# Altium project novena_evt1.PrjPcb (part 2 of 4)

## Sheet 06cpu_soc.SchDoc
size B
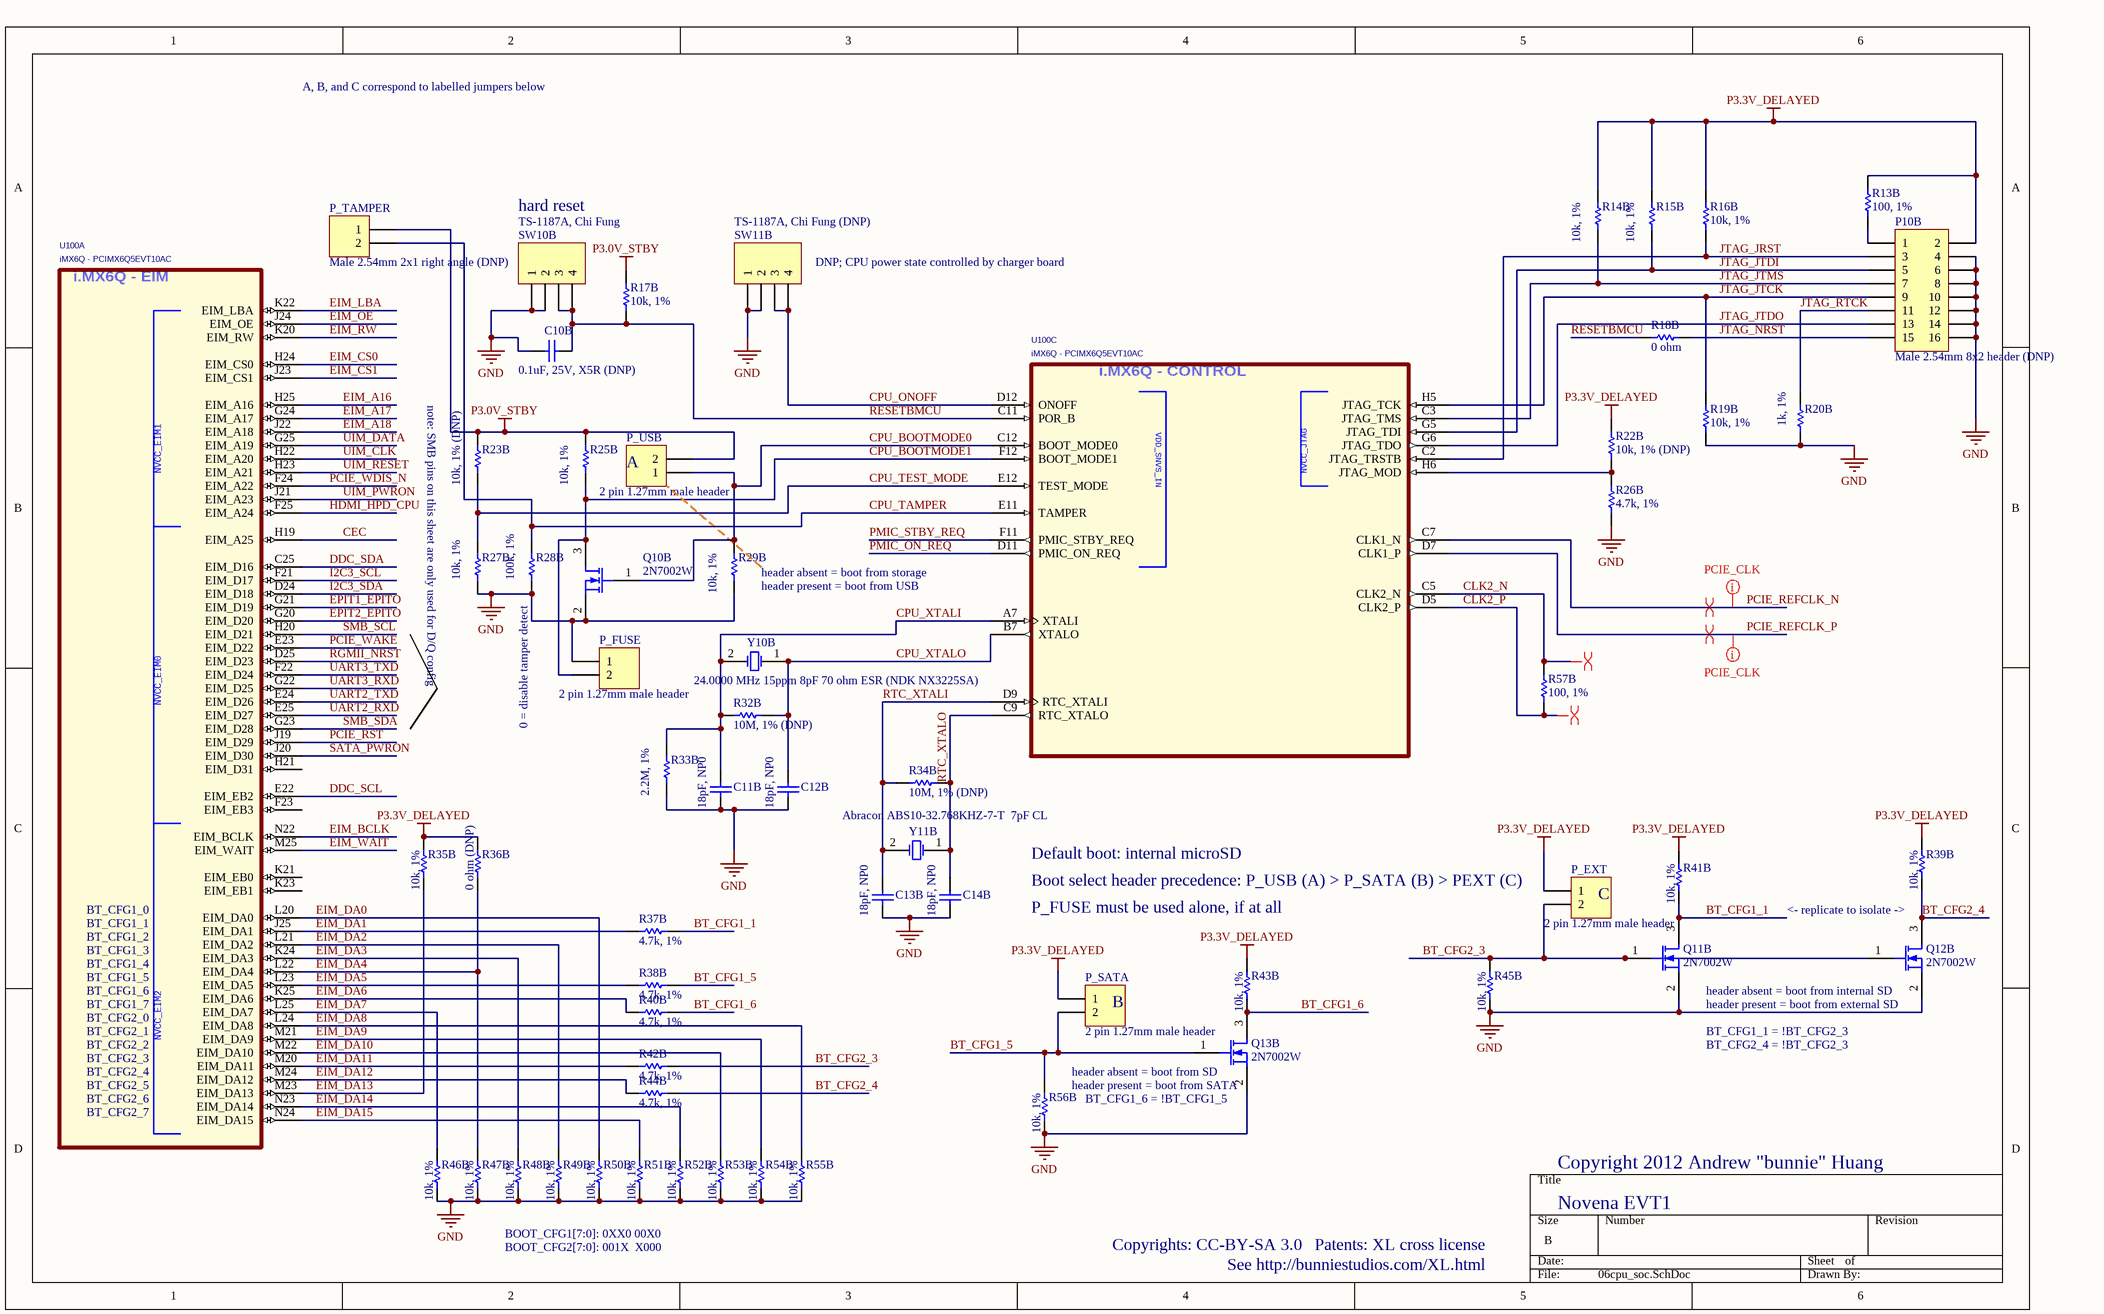
[diagram p5: 06cpu_soc.SchDoc]

### Parts
C10B  0.1uF, 25V, X5R (DNP)  [CAPC1005N]
C11B  18pF, NP0  [CAPC1005N]
C12B  18pF, NP0  [CAPC1005N]
C13B  18pF, NP0  [CAPC1005N]
C14B  18pF, NP0  [CAPC1005N]
P10B  Male 2.54mm 8x2 header (DNP)  [HDR2X8]
P_EXT  2 pin 1.27mm male header  [HEADER_2_1.27MM]
P_FUSE  2 pin 1.27mm male header  [HEADER_2_1.27MM]
P_SATA  2 pin 1.27mm male header  [HEADER_2_1.27MM]
P_TAMPER  Male 2.54mm 2x1 right angle (DNP)  [HDR1X2H]
P_USB  2 pin 1.27mm male header  [HEADER_2_1.27MM]
Q10B  2N7002W  [SOT323-3AN]
Q11B  2N7002W  [SOT323-3AN]
Q12B  2N7002W  [SOT323-3AN]
Q13B  2N7002W  [SOT323-3AN]
R13B  100, 1%  [RESC1005N]
R14B  10k, 1%  [RESC1005N]
R15B  10k, 1%  [RESC1005N]
R16B  10k, 1%  [RESC1005N]
R17B  10k, 1%  [RESC1005N]
R18B  0 ohm  [RESC1005N]
R19B  10k, 1%  [RESC1005N]
R20B  1k, 1%  [RESC1005N]
R22B  10k, 1% (DNP)  [RESC1005N]
R23B  10k, 1% (DNP)  [RESC1005N]
R25B  10k, 1%  [RESC1005N]
R26B  4.7k, 1%  [RESC1005N]
R27B  10k, 1%  [RESC1005N]
R28B  100k, 1%  [RESC1005N]
R29B  10k, 1%  [RESC1005N]
R32B  10M, 1% (DNP)  [RESC1005N]
R33B  2.2M, 1%  [RESC1005N]
R34B  10M, 1% (DNP)  [RESC1005N]
R35B  10k, 1%  [RESC1005N]
R36B  0 ohm (DNP)  [RESC1005N]
R37B  4.7k, 1%  [RESC1005N]
R38B  4.7k, 1%  [RESC1005N]
R39B  10k, 1%  [RESC1005N]
R40B  4.7k, 1%  [RESC1005N]
R41B  10k, 1%  [RESC1005N]
R42B  4.7k, 1%  [RESC1005N]
R43B  10k, 1%  [RESC1005N]
R44B  4.7k, 1%  [RESC1005N]
R45B  10k, 1%  [RESC1005N]
R46B  10k, 1%  [RESC1005N]
R47B  10k, 1%  [RESC1005N]
R48B  10k, 1%  [RESC1005N]
R49B  10k, 1%  [RESC1005N]
R50B  10k, 1%  [RESC1005N]
R51B  10k, 1%  [RESC1005N]
R52B  10k, 1%  [RESC1005N]
R53B  10k, 1%  [RESC1005N]
R54B  10k, 1%  [RESC1005N]
R55B  10k, 1%  [RESC1005N]
R56B  10k, 1%  [RESC1005N]
R57B  100, 1%  [RESC1005N]
SW10B  TS-1187A, Chi Fung  [SWITCH_TS-1187A]
SW11B  TS-1187A, Chi Fung (DNP)  [SWITCH_TS-1187A]
U100  iMX6Q - PCIMX6Q5EVT10AC  [FREESCALE_BGA624C80P25X25_2100X2100X216]  (parts A,C of 12)
Y10B  24.0000 MHz 15ppm 8pF 70 ohm ESR (NDK NX3225SA)  [NDK_NX3225SA]
Y11B  Abracon ABS10-32.768KHZ-7-T  7pF CL  [ABS10-32.768KHZ]

### Nets
GND: C10B.2 C11B.2 C12B.2 C13B.2 C14B.2 P10B.4 P10B.6 P10B.8 P10B.10 P10B.12 P10B.14 P10B.16 P_FUSE.1 Q10B.2(S) Q11B.2(S) Q12B.2(S) Q13B.2(S) R19B.1 R20B.1 R26B.1 R27B.1 R28B.1 R29B.1 R33B.2 R45B.2 R46B.2 R47B.2 R48B.2 R49B.2 R50B.2 R51B.2 R52B.2 R53B.2 R54B.2 R55B.2 R56B.2 SW10B.1 SW10B.2 SW11B.1 SW11B.2
P3.0V_STBY: P_TAMPER.1 P_USB.2 R17B.2 R23B.2 R25B.2
P3.3V_DELAYED: P10B.2 P_EXT.1 P_SATA.1 R13B.2 R14B.2 R15B.2 R16B.2 R22B.2 R35B.1 R36B.1 R39B.1 R41B.1 R43B.1
BT_CFG1_1: Q11B.3(D) R37B.2 R41B.2
BT_CFG1_5: P_SATA.2 Q13B.1(G) R38B.2 R56B.1
BT_CFG1_6: Q13B.3(D) R40B.2 R43B.2
BT_CFG2_3: P_EXT.2 Q11B.1(G) Q12B.1(G) R42B.2 R45B.1
BT_CFG2_4: Q12B.3(D) R39B.2 R44B.2
CEC: U100.H19(EIM_A25)
CLK2_N: R57B.2 U100.C5(CLK2_N)
CLK2_P: R57B.1 U100.D5(CLK2_P)
CPU_BOOTMODE0: P_USB.1 Q10B.1(G) R29B.2 U100.C12(BOOT_MODE0)
CPU_BOOTMODE1: P_FUSE.2 Q10B.3(D) R25B.1 U100.F12(BOOT_MODE1)
CPU_ONOFF: SW11B.3 SW11B.4 U100.D12(ONOFF)
CPU_TAMPER: P_TAMPER.2 R28B.2 U100.E11(TAMPER)
CPU_TEST_MODE: R23B.1 R27B.2 U100.E12(TEST_MODE)
CPU_XTALI: C11B.1 R32B.1 R33B.1 U100.A7(XTALI) Y10B.2(OSC2)
CPU_XTALO: C12B.1 R32B.2 U100.B7(XTALO) Y10B.1(OSC1)
DDC_SCL: U100.E22(EIM_EB2)
DDC_SDA: U100.C25(EIM_D16)
EIM_A16: U100.H25(EIM_A16)
EIM_A17: U100.G24(EIM_A17)
EIM_A18: U100.J22(EIM_A18)
EIM_BCLK: U100.N22(EIM_BCLK)
EIM_CS0: U100.H24(EIM_CS0)
EIM_CS1: U100.J23(EIM_CS1)
EIM_DA0: R50B.1 U100.L20(EIM_DA0)
EIM_DA1: R37B.1 U100.J25(EIM_DA1)
EIM_DA2: R49B.1 U100.L21(EIM_DA2)
EIM_DA3: R48B.1 U100.K24(EIM_DA3)
EIM_DA4: R36B.2 R47B.1 U100.L22(EIM_DA4)
EIM_DA5: R38B.1 U100.L23(EIM_DA5)
EIM_DA6: R40B.1 U100.K25(EIM_DA6)
EIM_DA7: R46B.1 U100.L25(EIM_DA7)
EIM_DA8: R55B.1 U100.L24(EIM_DA8)
EIM_DA9: R54B.1 U100.M21(EIM_DA9)
EIM_DA10: R53B.1 U100.M22(EIM_DA10)
EIM_DA11: R42B.1 U100.M20(EIM_DA11)
EIM_DA12: R44B.1 U100.M24(EIM_DA12)
EIM_DA13: R35B.2 U100.M23(EIM_DA13)
EIM_DA14: R52B.1 U100.N23(EIM_DA14)
EIM_DA15: R51B.1 U100.N24(EIM_DA15)
EIM_LBA: U100.K22(EIM_LBA)
EIM_OE: U100.J24(EIM_OE)
EIM_RW: U100.K20(EIM_RW)
EIM_WAIT: U100.M25(EIM_WAIT)
EPIT1_EPITO: U100.G21(EIM_D19)
EPIT2_EPITO: U100.G20(EIM_D20)
HDMI_HPD_CPU: U100.F25(EIM_A24)
I2C3_SCL: U100.F21(EIM_D17)
I2C3_SDA: U100.D24(EIM_D18)
JTAG_JRST: P10B.3 R16B.1 U100.C2(JTAG_TRSTB)
JTAG_JTCK: P10B.9 R19B.2 U100.H5(JTAG_TCK)
JTAG_JTDI: P10B.5 R15B.1 U100.G5(JTAG_TDI)
JTAG_JTDO: P10B.13 U100.G6(JTAG_TDO)
JTAG_JTMS: P10B.7 R14B.1 U100.C3(JTAG_TMS)
JTAG_NRST: P10B.15 R18B.1
JTAG_RTCK: P10B.11 R20B.2
PCIE_REFCLK_N: U100.C7(CLK1_N)
PCIE_REFCLK_P: U100.D7(CLK1_P)
PCIE_RST: U100.J19(EIM_D29)
PCIE_WAKE: U100.E23(EIM_D22)
PCIE_WDIS_N: U100.F24(EIM_A22)
PMIC_ON_REQ: U100.D11(PMIC_ON_REQ)
PMIC_STBY_REQ: U100.F11(PMIC_STBY_REQ)
RESETBMCU: C10B.1 R17B.1 R18B.2 SW10B.3 SW10B.4 U100.C11(POR_B)
RGMII_NRST: U100.D25(EIM_D23)
RTC_XTALI: C13B.1 R34B.1 U100.D9(RTC_XTALI) Y11B.2(OSC2)
RTC_XTALO: C14B.1 R34B.2 U100.C9(RTC_XTALO) Y11B.1(OSC1)
SATA_PWRON: U100.J20(EIM_D30)
SMB_SCL: U100.H20(EIM_D21)
SMB_SDA: U100.G23(EIM_D28)
UART2_RXD: U100.E25(EIM_D27)
UART2_TXD: U100.E24(EIM_D26)
UART3_RXD: U100.G22(EIM_D25)
UART3_TXD: U100.F22(EIM_D24)
UIM_CLK: U100.H22(EIM_A20)
UIM_DATA: U100.G25(EIM_A19)
UIM_PWRON: U100.J21(EIM_A23)
UIM_RESET: U100.H23(EIM_A21)
NetP10B_1: P10B.1 R13B.1
NetR22B_1: R22B.1 R26B.2 U100.H6(JTAG_MOD)

Not connected (* = marked no-connect by the designer): U100 F23(EIM_EB3) H21(EIM_D31) K21(EIM_EB0) K23(EIM_EB1)

### Layout directives
differential pair: CLK2_N, CLK2_P, PCIE_REFCLK_N, PCIE_REFCLK_P
net class PCIE_CLK: PCIE_REFCLK_N, PCIE_REFCLK_P

### Notes on the sheet
- A, B, and C correspond to labelled jumpers below
- hard reset
- (near SW11B) DNP; CPU power state controlled by charger board
- note: SMB pins on this sheet are only used for D/Q config
- A
- (near R29B) header absent = boot from storage
- (near R29B) header present = boot from USB
- (near R28B) 0 = disable tamper detect
- Default boot: internal microSD
- BT_CFG1_0
- BT_CFG1_1
- (near P_EXT) Boot select header precedence: P_USB (A) > P_SATA (B) > PEXT (C)
- P_FUSE must be used alone, if at all
- (near P_EXT) C
- <- replicate to isolate ->
- BT_CFG1_2
- BT_CFG1_3
- BT_CFG1_4
- BT_CFG1_5
- BT_CFG1_6
- (near Q12B) header absent = boot from internal SD
- BT_CFG1_7
- BT_CFG2_0
- BT_CFG2_1
- BT_CFG2_2
- BT_CFG2_3
- (near P_SATA) B
- header present = boot from external SD
- BT_CFG1_1 = !BT_CFG2_3
- BT_CFG2_4 = !BT_CFG2_3
- BT_CFG2_4
- BT_CFG2_5
- BT_CFG2_6
- BT_CFG2_7
- (near Q13B) header absent = boot from SD
- (near Q13B) header present = boot from SATA
- BT_CFG1_6 = !BT_CFG1_5
- Copyright 2012 Andrew "bunnie" Huang
- BOOT_CFG1[7:0]: 0XX0 00X0
- BOOT_CFG2[7:0]: 001X  X000
- Copyrights: CC-BY-SA 3.0
- Patents: XL cross license
- Novena EVT1
- See http://bunniestudios.com/XL.html
- (in symbol PCIMX6Q6VV1A, part A) i.MX6Q - EIM
- (in symbol PCIMX6Q6VV1A, part C) i.MX6Q - CONTROL

### Library data of the parts
C10B C11B C12B C13B C14B = Cap Semi: Capacitor (Semiconductor SIM Model); Published: 8-Jun-2000; LatestRevisionDate: 17-Jul-2002; LatestRevisionNote: Re-released for DXP Platform.; PackageReference: C1206; Publisher: Altium Limited
P10B = Header 8X2: Header, 8-Pin, Dual row; LatestRevisionDate: 17-Jul-2002; LatestRevisionNote: Re-released for DXP Platform.; Publisher: Altium Limited
P_EXT P_FUSE P_SATA P_USB = Header 2: Header, 2-Pin; LatestRevisionDate: 17-Jul-2002; LatestRevisionNote: Re-released for DXP Platform.; Publisher: Altium Limited
P_TAMPER = Header 2H: Header, 2-Pin, Right Angle; LatestRevisionDate: 17-Jul-2002; LatestRevisionNote: Re-released for DXP Platform.; Publisher: Altium Limited
Q10B Q11B Q12B Q13B = MOSFET-N: N-Channel MOSFET; Published: 8-Jun-2000; LatestRevisionDate: 17-Jul-2002; LatestRevisionNote: Re-released for DXP Platform.; PackageVersion: 1995/1996; PackageReference: E3; Publisher: Altium Limited
R13B R14B R15B R16B R17B R18B R19B R20B R22B R23B R25B R26B R27B R29B R32B R33B R34B R35B R36B R37B R38B R39B R40B R41B R42B R43B R44B R45B R46B R47B R48B R49B R50B R51B R52B R53B R54B R55B R56B R57B = Res1: Resistor; Value: 100k; Published: 8-Jun-2000; LatestRevisionDate: 17-Jul-2002; LatestRevisionNote: Re-released for DXP Platform.; PackageReference: AXIAL-0.3; Publisher: Altium Limited
R28B = Res1: Resistor; Published: 8-Jun-2000; LatestRevisionDate: 17-Jul-2002; LatestRevisionNote: Re-released for DXP Platform.; PackageReference: AXIAL-0.3; Publisher: Altium Limited; Value: 100k
SW10B SW11B = Header 4: Chi Fung TS-1187A; LatestRevisionDate: 17-Jul-2002; LatestRevisionNote: Re-released for DXP Platform.; Publisher: Altium Limited
U100 = PCIMX6Q6VV1A: PCIMX6Q5EVT10AC; AGILE_PN: TMP-WF-14526; DESCRIPTION: PLACEHOLDER FOR FREESCALE PART NUMBER PMCIMX6Q6VV1A.; MFG_NAME01: Freescale Semiconductor; PRE_APN: 344-01218; MFG_PN01: PCIMX6Q6VV1A; ROHS: Yes; HEIGHT: 2.16MM
Y10B Y11B = XTAL: Crystal Oscillator; Published: 8-Jun-2000; LatestRevisionDate: 17-Jul-2002; LatestRevisionNote: Re-released for DXP Platform.; PackageReference: R38; Publisher: Altium Limited

## Sheet 07sdcard.SchDoc
size B
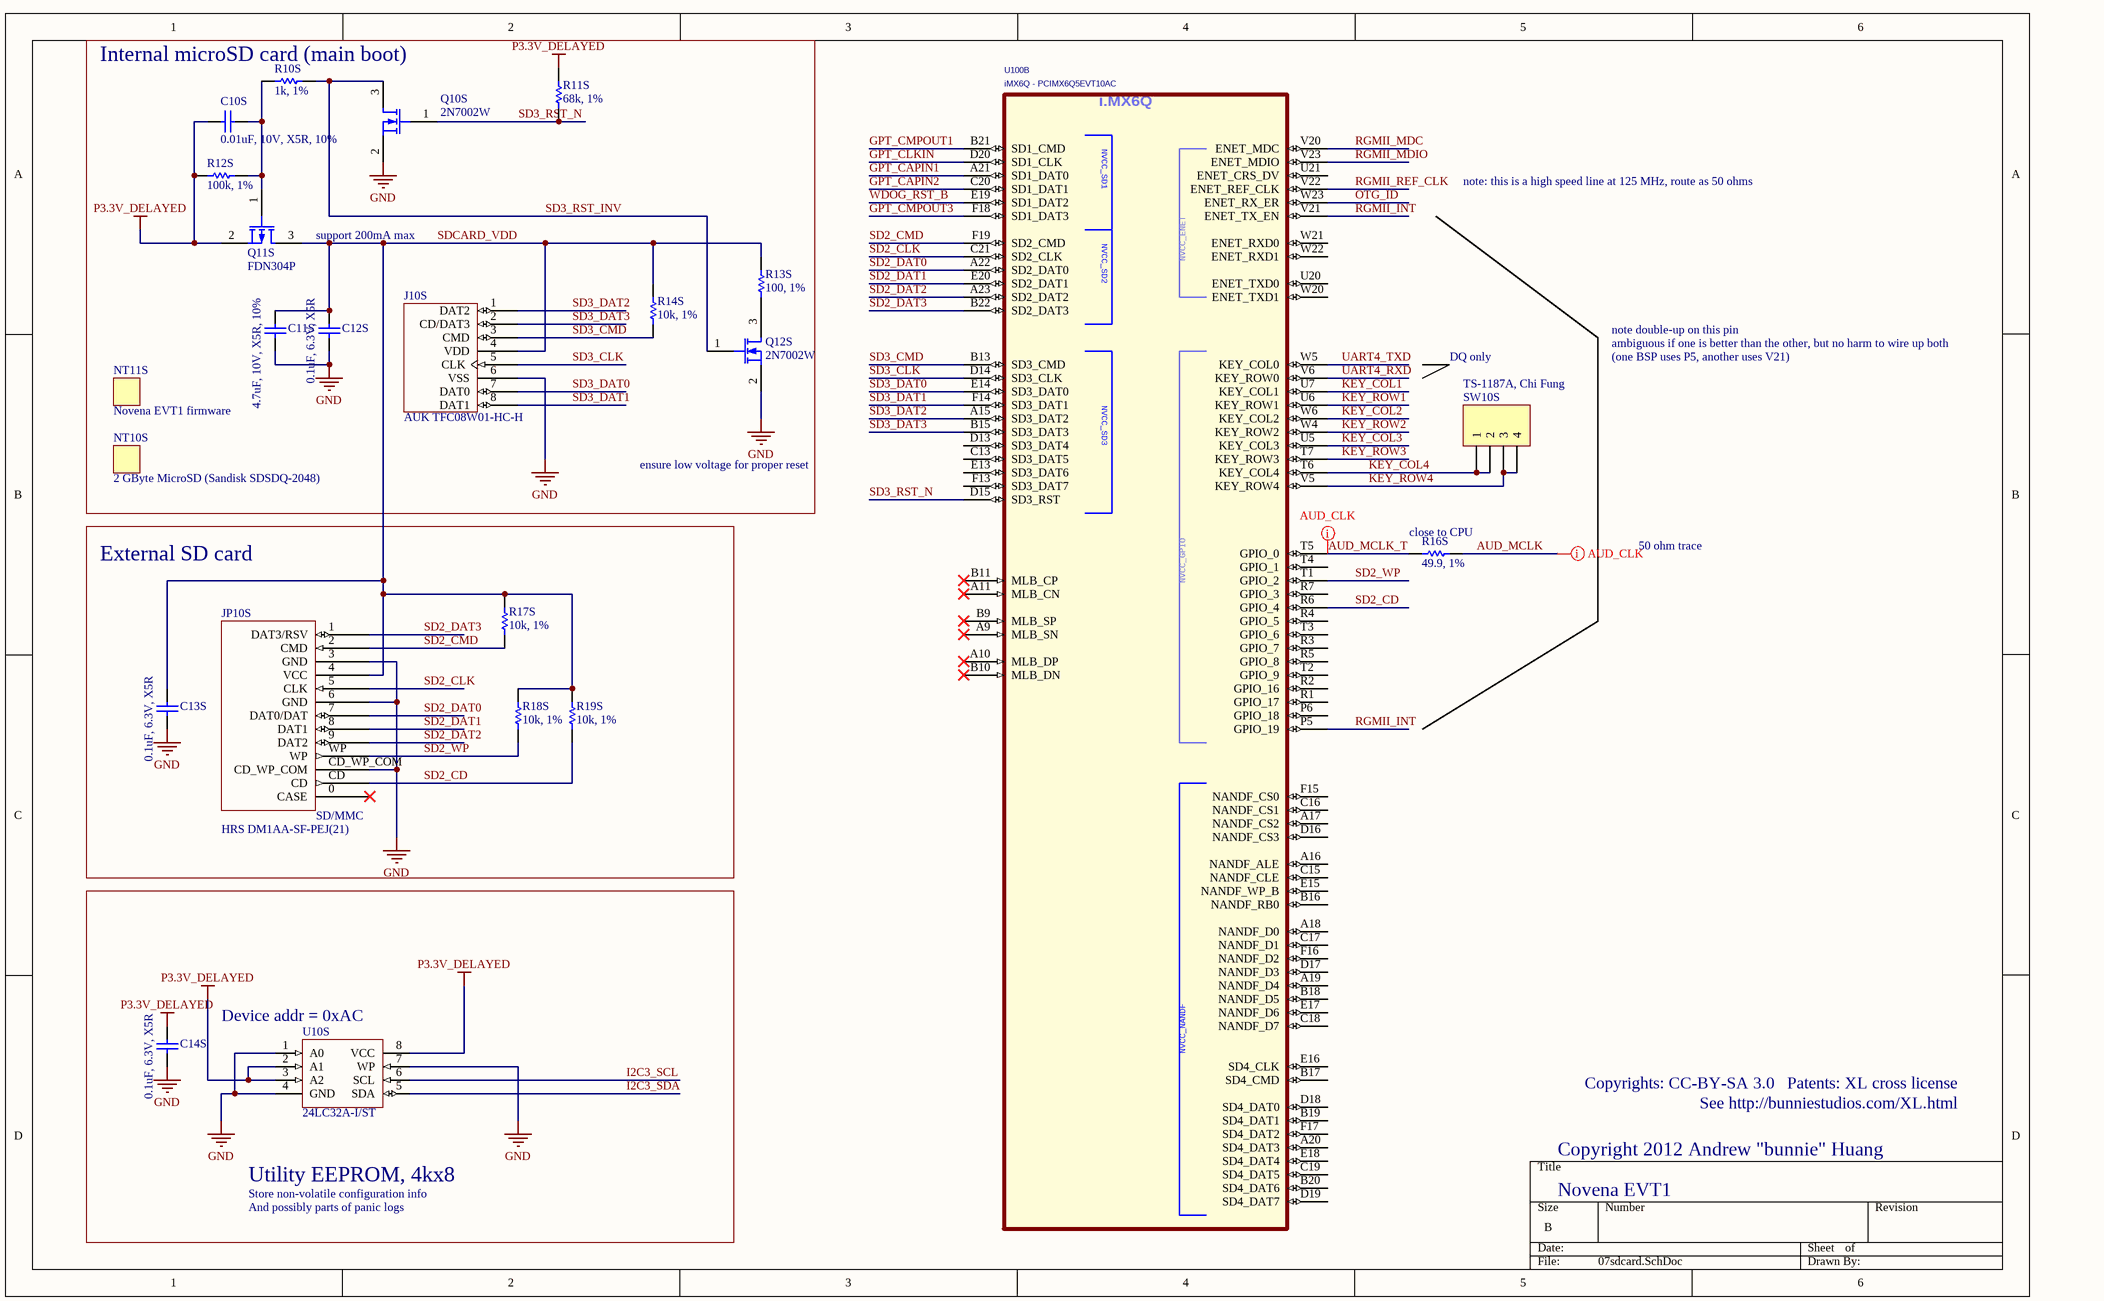
[diagram p6: 07sdcard.SchDoc]

### Parts
C10S  0.01uF, 10V, X5R, 10%  [CAPC0603N_B]
C11S  4.7uF, 10V, X5R, 10%  [CAPC1608N]
C12S  0.1uF, 6.3V, X5R  [CAPC0603N_B]
C13S  0.1uF, 6.3V, X5R  [CAPC0603N_B]
C14S  0.1uF, 6.3V, X5R  [CAPC0603N_B]
J10S  AUK TFC08W01-HC-H  [AUK_TFC08W01-HC-H]
JP10S  HRS DM1AA-SF-PEJ(21)  [HRS_DM1AA_SF_PEJ(21)]
NT10S  2 GByte MicroSD (Sandisk SDSDQ-2048)
NT11S  Novena EVT1 firmware
Q10S  2N7002W  [SOT323-3AN]
Q11S  FDN304P  [SOT23-3N]
Q12S  2N7002W  [SOT323-3AN]
R10S  1k, 1%  [RESC1005N]
R11S  68k, 1%  [RESC1005N]
R12S  100k, 1%  [RESC1005N]
R13S  100, 1%  [RESC1005N]
R14S  10k, 1%  [RESC1005N]
R16S  49.9, 1%  [RESC1005N]
R17S  10k, 1%  [RESC1005N]
R18S  10k, 1%  [RESC1005N]
R19S  10k, 1%  [RESC1005N]
SW10S  TS-1187A, Chi Fung  [SWITCH_TS-1187A]
U10S  24LC32A-I/ST  [TSOP65P640-8AN]
U100  iMX6Q - PCIMX6Q5EVT10AC  [FREESCALE_BGA624C80P25X25_2100X2100X216]  (part B of 12)

### Blocks framed on the sheet
Internal microSD card (main boot): C10S C11S C12S J10S NT10S NT11S Q10S Q11S Q12S R10S R11S R12S R13S R14S
External SD card: C13S JP10S R17S R18S R19S
Utility EEPROM, 4kx8: C14S U10S

### Nets
GND: C11S.2 C12S.2 C13S.2 C14S.2 J10S.6(VSS) JP10S.3(GND) JP10S.6(GND) JP10S.CD_WP_COM Q10S.2(S) Q12S.2(S) U10S.1(A0) U10S.4(GND) U10S.7(WP)
P3.3V_DELAYED: C10S.2 C14S.1 Q11S.2(S) R11S.1 R12S.2 U10S.2(A1) U10S.3(A2) U10S.8(VCC)
AUD_MCLK: R16S.1
AUD_MCLK_T: R16S.2 U100.T5(GPIO_0)
GPT_CAPIN1: U100.A21(SD1_DAT0)
GPT_CAPIN2: U100.C20(SD1_DAT1)
GPT_CLKIN: U100.D20(SD1_CLK)
GPT_CMPOUT1: U100.B21(SD1_CMD)
GPT_CMPOUT3: U100.F18(SD1_DAT3)
I2C3_SCL: U10S.6(SCL)
I2C3_SDA: U10S.5(SDA)
KEY_COL1: U100.U7(KEY_COL1)
KEY_COL2: U100.W6(KEY_COL2)
KEY_COL3: U100.U5(KEY_COL3)
KEY_COL4: SW10S.1 SW10S.2 U100.T6(KEY_COL4)
KEY_ROW1: U100.U6(KEY_ROW1)
KEY_ROW2: U100.W4(KEY_ROW2)
KEY_ROW3: U100.T7(KEY_ROW3)
KEY_ROW4: SW10S.3 SW10S.4 U100.V5(KEY_ROW4)
OTG_ID: U100.W23(ENET_RX_ER)
RGMII_INT: U100.P5(GPIO_19) U100.V21(ENET_TX_EN)
RGMII_MDC: U100.V20(ENET_MDC)
RGMII_MDIO: U100.V23(ENET_MDIO)
RGMII_REF_CLK: U100.V22(ENET_REF_CLK)
SD2_CD: JP10S.CD R19S.2 U100.R6(GPIO_4)
SD2_CLK: JP10S.5(CLK) U100.C21(SD2_CLK)
SD2_CMD: JP10S.2(CMD) R17S.2 U100.F19(SD2_CMD)
SD2_DAT0: JP10S.7(DAT0/DAT) U100.A22(SD2_DAT0)
SD2_DAT1: JP10S.8(DAT1) U100.E20(SD2_DAT1)
SD2_DAT2: JP10S.9(DAT2) U100.A23(SD2_DAT2)
SD2_DAT3: JP10S.1(DAT3/RSV) U100.B22(SD2_DAT3)
SD2_WP: JP10S.WP R18S.2 U100.T1(GPIO_2)
SD3_CLK: J10S.5(CLK) U100.D14(SD3_CLK)
SD3_CMD: J10S.3(CMD) R14S.2 U100.B13(SD3_CMD)
SD3_DAT0: J10S.7(DAT0) U100.E14(SD3_DAT0)
SD3_DAT1: J10S.8(DAT1) U100.F14(SD3_DAT1)
SD3_DAT2: J10S.1(DAT2) U100.A15(SD3_DAT2)
SD3_DAT3: J10S.2(CD/DAT3) U100.B15(SD3_DAT3)
SD3_RST_INV: Q10S.3(D) Q12S.1(G) R10S.1
SD3_RST_N: Q10S.1(G) R11S.2 U100.D15(SD3_RST)
SDCARD_VDD: C11S.1 C12S.1 C13S.1 J10S.4(VDD) JP10S.4(VCC) Q11S.3(D) R13S.1 R14S.1 R17S.1 R18S.1 R19S.1
UART4_RXD: U100.V6(KEY_ROW0)
UART4_TXD: U100.W5(KEY_COL0)
WDOG_RST_B: U100.E19(SD1_DAT2)
NetC10S_1: C10S.1 Q11S.1(G) R10S.2 R12S.1
NetQ12S_3: Q12S.3(D) R13S.2

Not connected (* = marked no-connect by the designer): JP10S 0(CASE)*; U100 A9(MLB_SN)* A10(MLB_DP)* A11(MLB_CN)* A16(NANDF_ALE) A17(NANDF_CS2) A18(NANDF_D0) A19(NANDF_D4) A20(SD4_DAT3) B9(MLB_SP)* B10(MLB_DN)* B11(MLB_CP)* B16(NANDF_RB0) B17(SD4_CMD) B18(NANDF_D5) B19(SD4_DAT1) B20(SD4_DAT6) C13(SD3_DAT5) C15(NANDF_CLE) C16(NANDF_CS1) C17(NANDF_D1) C18(NANDF_D7) C19(SD4_DAT5) D13(SD3_DAT4) D16(NANDF_CS3) D17(NANDF_D3) D18(SD4_DAT0) D19(SD4_DAT7) E13(SD3_DAT6) E15(NANDF_WP_B) E16(SD4_CLK) E17(NANDF_D6) E18(SD4_DAT4) F13(SD3_DAT7) F15(NANDF_CS0) F16(NANDF_D2) F17(SD4_DAT2) P6(GPIO_18) R1(GPIO_17) R2(GPIO_16) R3(GPIO_7) R4(GPIO_5) R5(GPIO_8) R7(GPIO_3) T2(GPIO_9) T3(GPIO_6) T4(GPIO_1) U20(ENET_TXD0) U21(ENET_CRS_DV) W20(ENET_TXD1) W21(ENET_RXD0) W22(ENET_RXD1)

### Layout directives
net class AUD_CLK: AUD_MCLK, AUD_MCLK_T

### Notes on the sheet
- (near Q11S) support 200mA max
- note: this is a high speed line at 125 MHz, route as 50 ohms
- DQ only
- note double-up on this pin
- ambiguous if one is better than the other, but no harm to wire up both
- (one BSP uses P5, another uses V21)
- ensure low voltage for proper reset
- (near R16S) close to CPU
- 50 ohm trace
- (near U10S) Device addr = 0xAC
- Copyrights: CC-BY-SA 3.0
- See http://bunniestudios.com/XL.html
- Patents: XL cross license
- Copyright 2012 Andrew "bunnie" Huang
- Store non-volatile configuration info
- And possibly parts of panic logs
- Novena EVT1
- (in symbol HRS_DM1AA_SF_PEJ(21)) SD/MMC
- (in symbol PCIMX6Q6VV1A, part B) i.MX6Q

### Library data of the parts
C10S C11S C12S C13S C14S = Cap Semi: Capacitor (Semiconductor SIM Model); Published: 8-Jun-2000; LatestRevisionDate: 17-Jul-2002; LatestRevisionNote: Re-released for DXP Platform.; PackageReference: C1206; Publisher: Altium Limited
J10S = MICRO_SD: Captive Micro-SD card for firmware images
JP10S = HRS_DM1AA_SF_PEJ(21): SD card connector
NT10S NT11S = NOTE: Placeholder for non-electrical BOM items
Q10S Q12S = MOSFET-N: N-Channel MOSFET; Published: 8-Jun-2000; LatestRevisionDate: 17-Jul-2002; LatestRevisionNote: Re-released for DXP Platform.; PackageVersion: 1995/1996; PackageReference: E3; Publisher: Altium Limited
Q11S = MOSFET-P: P-Channel MOSFET; Published: 8-Jun-2000; LatestRevisionDate: 17-Jul-2002; LatestRevisionNote: Re-released for DXP Platform.; PackageVersion: 1995/1996; PackageReference: E3; Publisher: Altium Limited; PackageDescription: TO, Flat Index; 3 In-Line, Axial Leads; Body Dia. 4.6mm; Lead Dia. 0.5 mm (max)
R10S R11S R13S R14S R16S R17S R18S R19S = Res1: Resistor; Value: 100k; Published: 8-Jun-2000; LatestRevisionDate: 17-Jul-2002; LatestRevisionNote: Re-released for DXP Platform.; PackageReference: AXIAL-0.3; Publisher: Altium Limited
R12S = Res1: Resistor; Published: 8-Jun-2000; LatestRevisionDate: 17-Jul-2002; LatestRevisionNote: Re-released for DXP Platform.; PackageReference: AXIAL-0.3; Publisher: Altium Limited; Value: 100k
SW10S = Header 4: Chi Fung TS-1187A; LatestRevisionDate: 17-Jul-2002; LatestRevisionNote: Re-released for DXP Platform.; Publisher: Altium Limited
U10S = AT24C08: 8kbit (1kx8) I2C EEPROM
U100 = PCIMX6Q6VV1A: as U100 on sheet 06cpu_soc; MFG_PN01: PCIMX6Q6VV1A; ROHS: Yes; HEIGHT: 2.16MM

## Sheet 08usb.SchDoc
size C
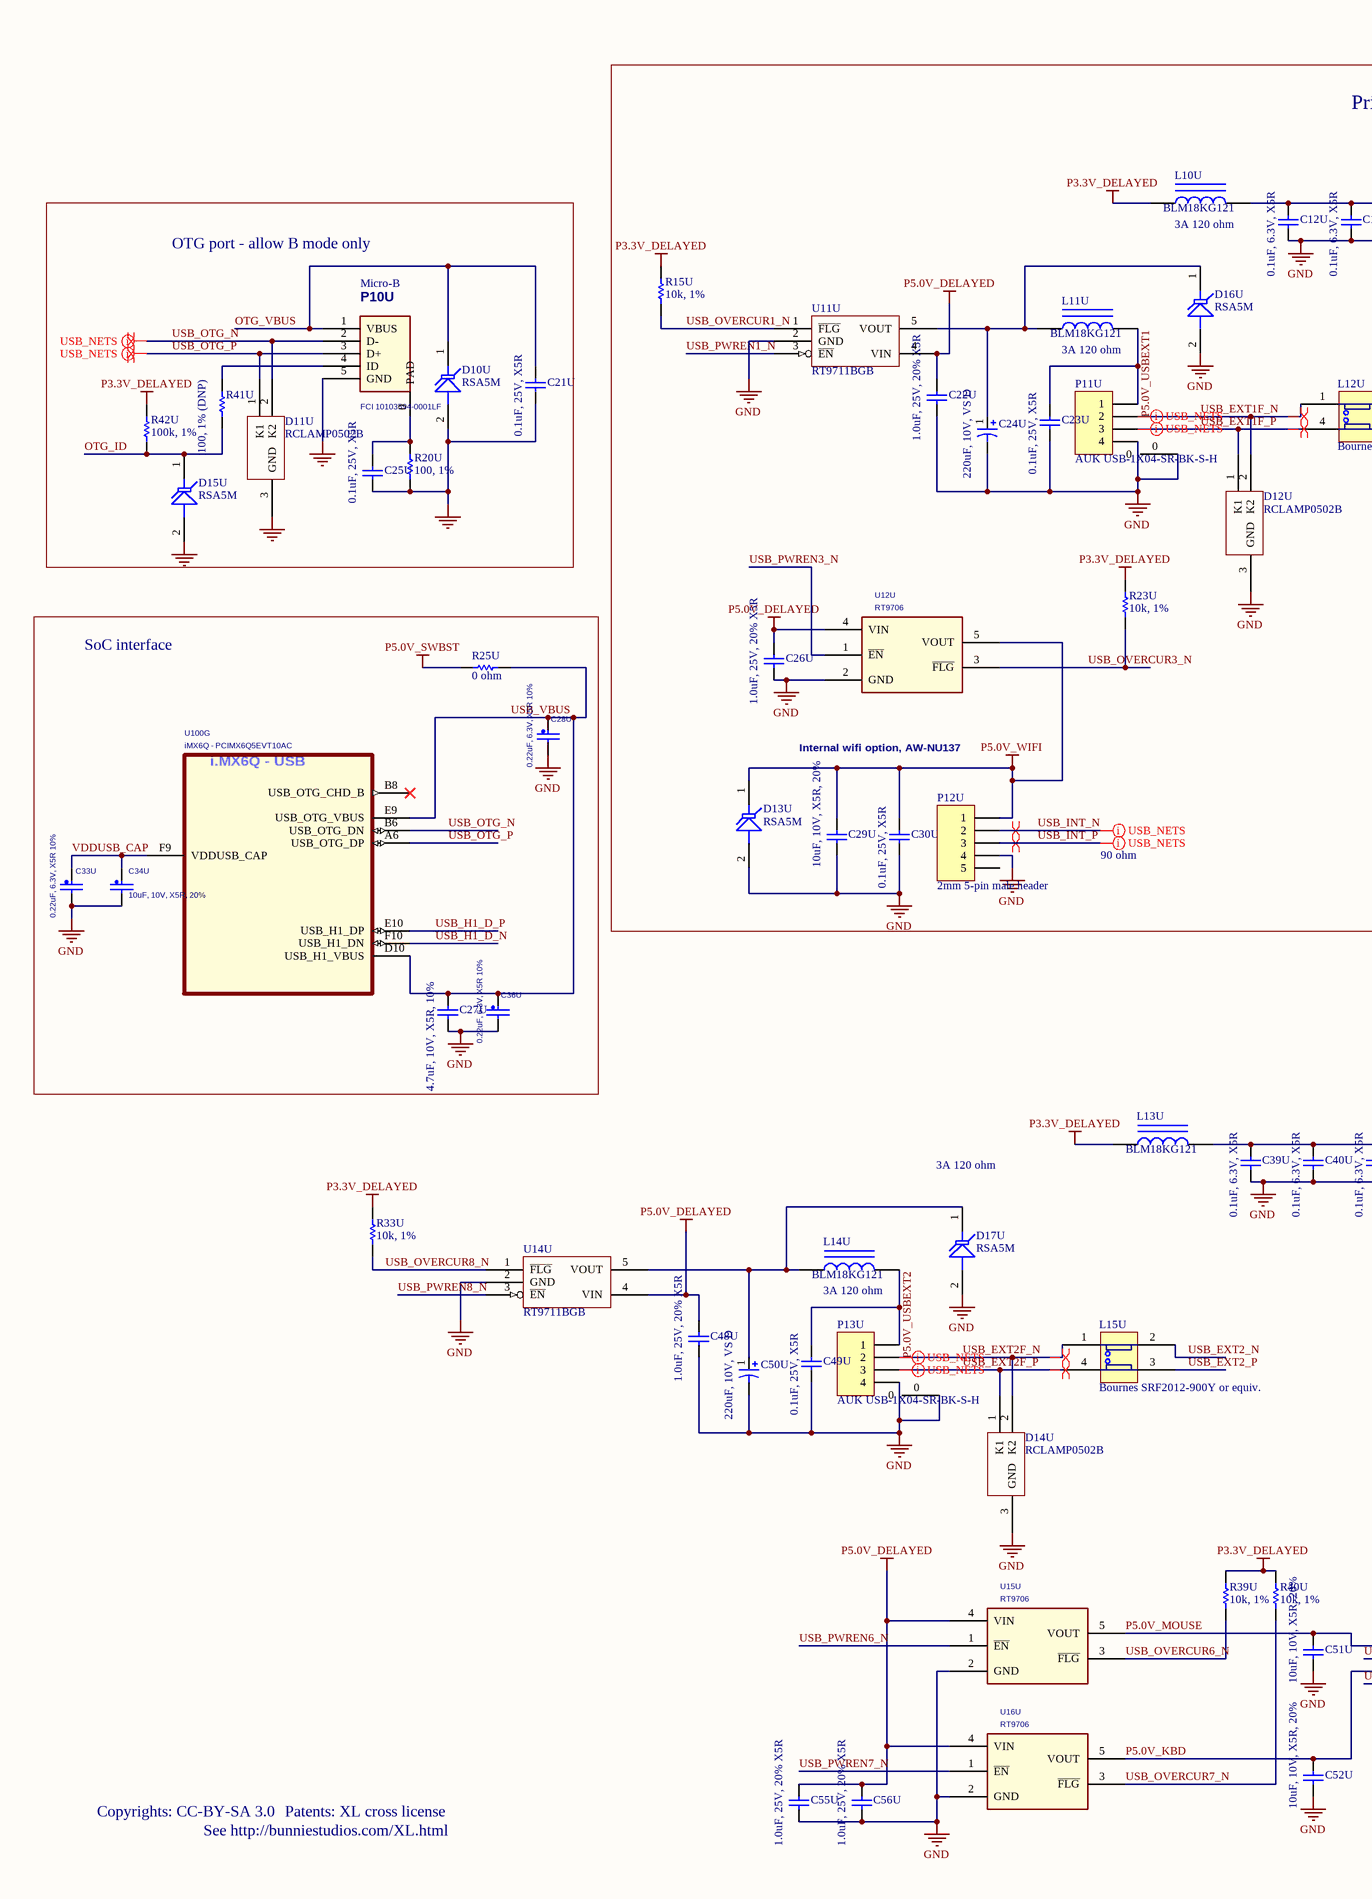
[diagram p7: 08usb.SchDoc, left]
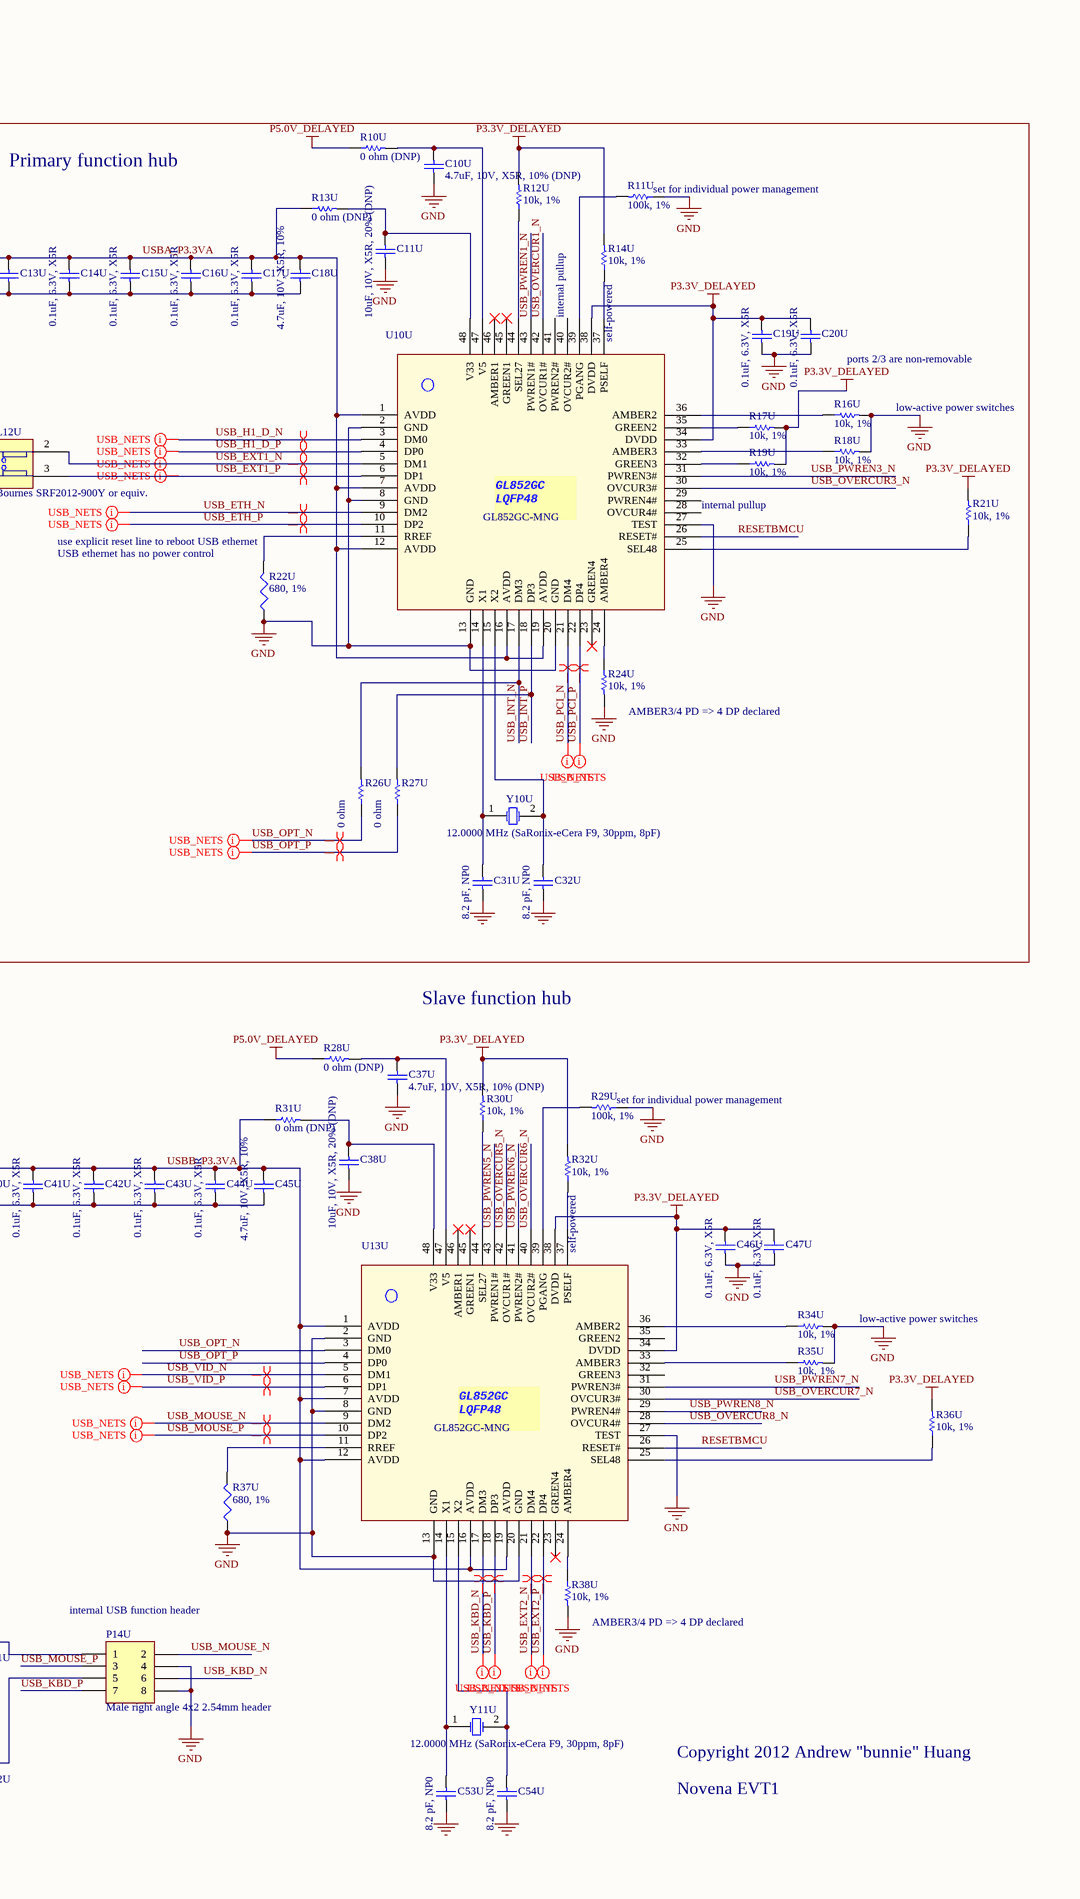
[diagram p8: 08usb.SchDoc, right]

### Parts
C10U  4.7uF, 10V, X5R, 10% (DNP)  [CAPC1608N]
C11U  10uF, 10V, X5R, 20% (DNP)  [CAPC1608N]
C12U  0.1uF, 6.3V, X5R  [CAPC0603N_B]
C13U  0.1uF, 6.3V, X5R  [CAPC0603N_B]
C14U  0.1uF, 6.3V, X5R  [CAPC0603N_B]
C15U  0.1uF, 6.3V, X5R  [CAPC0603N_B]
C16U  0.1uF, 6.3V, X5R  [CAPC0603N_B]
C17U  0.1uF, 6.3V, X5R  [CAPC0603N_B]
C18U  4.7uF, 10V, X5R, 10%  [CAPC1608N]
C19U  0.1uF, 6.3V, X5R  [CAPC0603N_B]
C20U  0.1uF, 6.3V, X5R  [CAPC0603N_B]
C21U  0.1uF, 25V, X5R  [CAPC1005N]
C22U  1.0uF, 25V, 20% X5R  [CAPC1608N]
C23U  0.1uF, 25V, X5R  [CAPC1005N]
C24U  220uF, 10V, VS D  [ALCAP_D]
C25U  0.1uF, 25V, X5R  [CAPC1005N]
C26U  1.0uF, 25V, 20% X5R  [CAPC1608N]
C27U  4.7uF, 10V, X5R, 10%  [CAPC1608N_HD]
C28U  0.22uF, 6.3V, X5R 10%  [CAPC0603N_B]
C29U  10uF, 10V, X5R, 20%  [CAPC1608N]
C30U  0.1uF, 25V, X5R  [CAPC1005N]
C31U  8.2 pF, NP0  [CAPC1005N]
C32U  8.2 pF, NP0  [CAPC1005N]
C33U  0.22uF, 6.3V, X5R 10%  [CAPC0603N_B]
C34U  10uF, 10V, X5R, 20%  [CAPC1608N_HD]
C36U  0.22uF, 6.3V, X5R 10%  [CAPC0603N_B]
C37U  4.7uF, 10V, X5R, 10% (DNP)  [CAPC1608N]
C38U  10uF, 10V, X5R, 20% (DNP)  [CAPC1608N]
C39U  0.1uF, 6.3V, X5R  [CAPC0603N_B]
C40U  0.1uF, 6.3V, X5R  [CAPC0603N_B]
C41U  0.1uF, 6.3V, X5R  [CAPC0603N_B]
C42U  0.1uF, 6.3V, X5R  [CAPC0603N_B]
C43U  0.1uF, 6.3V, X5R  [CAPC0603N_B]
C44U  0.1uF, 6.3V, X5R  [CAPC0603N_B]
C45U  4.7uF, 10V, X5R, 10%  [CAPC1608N]
C46U  0.1uF, 6.3V, X5R  [CAPC0603N_B]
C47U  0.1uF, 6.3V, X5R  [CAPC0603N_B]
C48U  1.0uF, 25V, 20% X5R  [CAPC1608N]
C49U  0.1uF, 25V, X5R  [CAPC1005N]
C50U  220uF, 10V, VS D  [ALCAP_D]
C51U  10uF, 10V, X5R, 20%  [CAPC1608N]
C52U  10uF, 10V, X5R, 20%  [CAPC1608N]
C53U  8.2 pF, NP0  [CAPC1005N]
C54U  8.2 pF, NP0  [CAPC1005N]
C55U  1.0uF, 25V, 20% X5R  [CAPC1608N]
C56U  1.0uF, 25V, 20% X5R  [CAPC1608N]
D10U  RSA5M  [SOD123/X.85]
D11U  RCLAMP0502B  [SOT-523]
D12U  RCLAMP0502B  [SOT-523]
D13U  RSA5M  [SOD123/X.85]
D14U  RCLAMP0502B  [SOT-523]
D15U  RSA5M  [SOD123/X.85]
D16U  RSA5M  [SOD123/X.85]
D17U  RSA5M  [SOD123/X.85]
L10U  BLM18KG121  value 3A 120 ohm  [INDC1608AN]
L11U  BLM18KG121  value 3A 120 ohm  [INDC1608AN]
L12U  Bournes SRF2012-900Y or equiv.  [USB_CM_CHOKE_0805]
L13U  BLM18KG121  value 3A 120 ohm  [INDC1608AN]
L14U  BLM18KG121  value 3A 120 ohm  [INDC1608AN]
L15U  Bournes SRF2012-900Y or equiv.  [USB_CM_CHOKE_0805]
P10U  FCI 10103594-0001LF  [USB_MICRO_B_SMT]
P11U  AUK USB-1X04-SR-BK-S-H  [USB_TYPEA_TH_SINGLE]
P12U  2mm 5-pin male header  [AW_NU137]
P13U  AUK USB-1X04-SR-BK-S-H  [USB_TYPEA_TH_SINGLE]
P14U  Male right angle 4x2 2.54mm header  [HDR2X4H]
R10U  0 ohm (DNP)  [RESC1005N]
R11U  100k, 1%  [RESC1005N]
R12U  10k, 1%  [RESC1005N]
R13U  0 ohm (DNP)  [RESC1005N]
R14U  10k, 1%  [RESC1005N]
R15U  10k, 1%  [RESC1005N]
R16U  10k, 1%  [RESC1005N]
R17U  10k, 1%  [RESC1005N]
R18U  10k, 1%  [RESC1005N]
R19U  10k, 1%  [RESC1005N]
R20U  100, 1%  [RESC1005N]
R21U  10k, 1%  [RESC1005N]
R22U  680, 1%  [RESC1005N]
R23U  10k, 1%  [RESC1005N]
R24U  10k, 1%  [RESC1005N]
R25U  0 ohm  [RESC1005N]
R26U  0 ohm  [RESC1005N]
R27U  0 ohm  [RESC1005N]
R28U  0 ohm (DNP)  [RESC1005N]
R29U  100k, 1%  [RESC1005N]
R30U  10k, 1%  [RESC1005N]
R31U  0 ohm (DNP)  [RESC1005N]
R32U  10k, 1%  [RESC1005N]
R33U  10k, 1%  [RESC1005N]
R34U  10k, 1%  [RESC1005N]
R35U  10k, 1%  [RESC1005N]
R36U  10k, 1%  [RESC1005N]
R37U  680, 1%  [RESC1005N]
R38U  10k, 1%  [RESC1005N]
R39U  10k, 1%  [RESC1005N]
R40U  10k, 1%  [RESC1005N]
R41U  100, 1% (DNP)  [RESC1005N]
R42U  100k, 1%  [RESC1005N]
U10U  GL852GC-MNG  [SQFP50P900X900-48N]
U11U  RT9711BGB  [SOT23-5AN]
U12U  RT9706  [SOT23-5AN]
U13U  GL852GC-MNG  [SQFP50P900X900-48N]
U14U  RT9711BGB  [SOT23-5AN]
U15U  RT9706  [SOT23-5AN]
U16U  RT9706  [SOT23-5AN]
U100  iMX6Q - PCIMX6Q5EVT10AC  [FREESCALE_BGA624C80P25X25_2100X2100X216]  (part G of 12)
Y10U  12.0000 MHz (SaRonix-eCera F9, 30ppm, 8pF)  [NDK_NX5032A]
Y11U  12.0000 MHz (SaRonix-eCera F9, 30ppm, 8pF)  [NDK_NX5032A]

### Blocks framed on the sheet
Primary function hub: C10U C11U C12U C13U C14U C15U C16U C17U C18U C19U C20U C22U C23U C24U C26U C29U C30U C31U C32U D12U D13U D16U L10U L11U L12U P11U P12U R10U R11U R12U R13U R14U R15U R16U R17U R18U R19U R21U R22U R23U R24U R26U R27U U10U U11U U12U Y10U
OTG port - allow B mode only: C21U C25U D10U D11U D15U P10U R20U R41U R42U
SoC interface: C27U C28U C33U C34U C36U R25U U100

### Nets
GND: C10U.2 C11U.2 C12U.2 C13U.2 C14U.2 C15U.2 C16U.2 C17U.2 C18U.2 C19U.2 C20U.2 C21U.2 C22U.2 C23U.2 C24U.2 C25U.2 C26U.2 C27U.2 C28U.2 C29U.2 C30U.2 C31U.2 C32U.2 C33U.2 C34U.2 C36U.2 C37U.2 C38U.2 C39U.2 C40U.2 C41U.2 C42U.2 C43U.2 C44U.2 C45U.2 C46U.2 C47U.2 C48U.2 C49U.2 C50U.2 C51U.2 C52U.2 C53U.2 C54U.2 C55U.2 C56U.2 D10U.2(A) D11U.3(GND) D12U.3(GND) D13U.2(A) D14U.3(GND) D15U.2(A) D16U.2(A) D17U.2(A) P10U.5(GND) P11U.0 P11U.4 P12U.4 P13U.0 P13U.4 P14U.4 P14U.8 R11U.1 R16U.2 R18U.2 R20U.2 R22U.1 R24U.2 R29U.1 R34U.2 R35U.2 R37U.1 R38U.2 U10U.2(GND) U10U.8(GND) U10U.13(GND) U10U.20(GND) U10U.27(TEST) U11U.2(GND) U12U.2(GND) U13U.2(GND) U13U.8(GND) U13U.13(GND) U13U.20(GND) U13U.27(TEST) U14U.2(GND) U15U.2(GND) U16U.2(GND)
P3.3V_DELAYED: C19U.1 C20U.1 C46U.1 C47U.1 L10U.1 L13U.1 R12U.2 R14U.2 R15U.2 R17U.2 R19U.2 R21U.2 R23U.2 R30U.2 R32U.2 R33U.2 R36U.2 R39U.1 R40U.1 R42U.2 U10U.34(DVDD) U10U.38(DVDD) U13U.34(DVDD) U13U.38(DVDD)
P5.0V_DELAYED: C22U.1 C26U.1 C48U.1 C55U.1 C56U.1 R10U.1 R28U.1 U11U.4(VIN) U12U.4(VIN) U14U.4(VIN) U15U.4(VIN) U16U.4(VIN)
P5.0V_SWBST: R25U.2
P5.0V_WIFI: C29U.1 C30U.1 D13U.1(K) P12U.1 U12U.5(VOUT)
OTG_ID: D15U.1(K) R41U.1 R42U.1
OTG_VBUS: C21U.1 D10U.1(K) P10U.1(VBUS)
P5.0V_KBD: C52U.1 P14U.5 U16U.5(VOUT)
P5.0V_MOUSE: C51U.1 P14U.1 U15U.5(VOUT)
P5.0V_USBEXT1: C23U.1 L11U.2 P11U.1
P5.0V_USBEXT2: C49U.1 L14U.2 P13U.1
RESETBMCU: U10U.26(RESET#) U13U.26(RESET#)
USB_ETH_N: U10U.9(DM2)
USB_ETH_P: U10U.10(DP2)
USB_EXT1_N: L12U.2 U10U.5(DM1)
USB_EXT1_P: L12U.3 U10U.6(DP1)
USB_EXT1F_N: D12U.2(K2) L12U.1 P11U.2
USB_EXT1F_P: D12U.1(K1) L12U.4 P11U.3
USB_EXT2_N: L15U.2 U13U.21(DM4)
USB_EXT2_P: L15U.3 U13U.22(DP4)
USB_EXT2F_N: D14U.2(K2) L15U.1 P13U.2
USB_EXT2F_P: D14U.1(K1) L15U.4 P13U.3
USB_H1_D_N: U10U.3(DM0) U100.F10(USB_H1_DN)
USB_H1_D_P: U10U.4(DP0) U100.E10(USB_H1_DP)
USB_INT_N: P12U.2 R26U.2 U10U.17(DM3)
USB_INT_P: P12U.3 R27U.2 U10U.18(DP3)
USB_KBD_N: P14U.6 U13U.17(DM3)
USB_KBD_P: P14U.7 U13U.18(DP3)
USB_MOUSE_N: P14U.2 U13U.9(DM2)
USB_MOUSE_P: P14U.3 U13U.10(DP2)
USB_OPT_N: R26U.1 U13U.3(DM0)
USB_OPT_P: R27U.1 U13U.4(DP0)
USB_OTG_N: D11U.2(K2) P10U.2(D-) U100.B6(USB_OTG_DN)
USB_OTG_P: D11U.1(K1) P10U.3(D+) U100.A6(USB_OTG_DP)
USB_OVERCUR1_N: R15U.1 U10U.42(OVCUR1#) U11U.1(~{FLG})
USB_OVERCUR3_N: R23U.1 U10U.30(OVCUR3#) U12U.3(~{FLG})
USB_OVERCUR5_N: U13U.42(OVCUR1#)
USB_OVERCUR6_N: R39U.2 U13U.40(OVCUR2#) U15U.3(~{FLG})
USB_OVERCUR7_N: R40U.2 U13U.30(OVCUR3#) U16U.3(~{FLG})
USB_OVERCUR8_N: R33U.1 U13U.28(OVCUR4#) U14U.1(~{FLG})
USB_PCI_N: U10U.21(DM4)
USB_PCI_P: U10U.22(DP4)
USB_PWREN1_N: U10U.43(PWREN1#) U11U.3(~{EN})
USB_PWREN3_N: U10U.31(PWREN3#) U12U.1(~{EN})
USB_PWREN5_N: U13U.43(PWREN1#)
USB_PWREN6_N: U13U.41(PWREN2#) U15U.1(~{EN})
USB_PWREN7_N: U13U.31(PWREN3#) U16U.1(~{EN})
USB_PWREN8_N: U13U.29(PWREN4#) U14U.3(~{EN})
USB_VBUS: C27U.1 C28U.1 C36U.1 R25U.1 U100.D10(USB_H1_VBUS) U100.E9(USB_OTG_VBUS)
USB_VID_N: U13U.5(DM1)
USB_VID_P: U13U.6(DP1)
USBA_P3.3VA: C12U.1 C13U.1 C14U.1 C15U.1 C16U.1 C17U.1 C18U.1 L10U.2 R13U.1 U10U.1(AVDD) U10U.7(AVDD) U10U.12(AVDD) U10U.16(AVDD) U10U.19(AVDD)
USBB_P3.3VA: C39U.1 C40U.1 C41U.1 C42U.1 C43U.1 C44U.1 C45U.1 L13U.2 R31U.1 U13U.1(AVDD) U13U.7(AVDD) U13U.12(AVDD) U13U.16(AVDD) U13U.19(AVDD)
VDDUSB_CAP: C33U.1 C34U.1 U100.F9(VDDUSB_CAP)
NetC10U_1: C10U.1 R10U.2 U10U.47(V5)
NetC11U_1: C11U.1 R13U.2 U10U.48(V33)
NetC24U_1: C24U.1 D16U.1(K) L11U.1 U11U.5(VOUT)
NetC25U_1: C25U.1 P10U.0(PAD) R20U.1
NetC31U_1: C31U.1 U10U.14(X1) Y10U.1(OSC1)
NetC32U_1: C32U.1 U10U.15(X2) Y10U.2(OSC2)
NetC37U_1: C37U.1 R28U.2 U13U.47(V5)
NetC38U_1: C38U.1 R31U.2 U13U.48(V33)
NetC50U_1: C50U.1 D17U.1(K) L14U.1 U14U.5(VOUT)
NetC53U_1: C53U.1 U13U.14(X1) Y11U.1(OSC1)
NetC54U_1: C54U.1 U13U.15(X2) Y11U.2(OSC2)
NetP10U_4: P10U.4(ID) R41U.2
NetR11U_2: R11U.2 U10U.39(PGANG)
NetR12U_1: R12U.1 U10U.44(SEL27)
NetR14U_1: R14U.1 U10U.37(PSELF)
NetR16U_1: R16U.1 U10U.36(AMBER2)
NetR17U_1: R17U.1 U10U.35(GREEN2)
NetR18U_1: R18U.1 U10U.33(AMBER3)
NetR19U_1: R19U.1 U10U.32(GREEN3)
NetR21U_1: R21U.1 U10U.25(SEL48)
NetR22U_2: R22U.2 U10U.11(RREF)
NetR24U_1: R24U.1 U10U.24(AMBER4)
NetR29U_2: R29U.2 U13U.39(PGANG)
NetR30U_1: R30U.1 U13U.44(SEL27)
NetR32U_1: R32U.1 U13U.37(PSELF)
NetR34U_1: R34U.1 U13U.36(AMBER2)
NetR35U_1: R35U.1 U13U.33(AMBER3)
NetR36U_1: R36U.1 U13U.25(SEL48)
NetR37U_2: R37U.2 U13U.11(RREF)
NetR38U_1: R38U.1 U13U.24(AMBER4)

Not connected (* = marked no-connect by the designer): P12U 5; U10U 23(GREEN4)* 28(OVCUR4#) 29(PWREN4#) 40(OVCUR2#) 41(PWREN2#) 45(GREEN1)* 46(AMBER1)*; U13U 23(GREEN4)* 32(GREEN3) 35(GREEN2) 45(GREEN1)* 46(AMBER1)*; U100 B8(USB_OTG_CHD_B)*

### Layout directives
net class USB_NETS: USB_ETH_N, USB_ETH_P, USB_EXT1_N, USB_EXT1_P, USB_EXT1F_N, USB_EXT1F_P, USB_EXT2_N, USB_EXT2_P, USB_EXT2F_N, USB_EXT2F_P, USB_H1_D_N, USB_H1_D_P, USB_INT_N, USB_KBD_N, USB_KBD_P, USB_MOUSE_N, USB_MOUSE_P, USB_OPT_N, USB_OPT_P, USB_OTG_N, USB_OTG_P, USB_PCI_N, USB_PCI_P, USB_VID_N, USB_VID_P
differential pair: USB_ETH_N, USB_ETH_P, USB_EXT1_N, USB_EXT1_P, USB_EXT1F_N, USB_EXT1F_P, USB_EXT2_N, USB_EXT2_P, USB_EXT2F_N, USB_EXT2F_P, USB_H1_D_N, USB_H1_D_P, USB_INT_N, USB_INT_P, USB_KBD_N, USB_KBD_P, USB_MOUSE_N, USB_MOUSE_P, USB_OPT_N, USB_OPT_P, USB_OTG_N, USB_OTG_P, USB_PCI_N, USB_PCI_P, USB_VID_N, USB_VID_P
net class USB_NETS; Impedance: 90 ohm: USB_INT_P

### Notes on the sheet
- (near R11U) set for individual power management
- (near P10U) Micro-B
- internal pullup
- self-powered
- ports 2/3 are non-removable
- low-active power switches
- (near R22U) USB ethernet has no power control
- (near R22U) use explicit reset line to reboot USB ethernet
- (near R24U) AMBER3/4 PD => 4 DP declared
- Internal wifi option, AW-NU137
- Slave function hub
- (near R29U) set for individual power management
- (near P14U) internal USB function header
- (near R38U) AMBER3/4 PD => 4 DP declared
- Copyright 2012 Andrew "bunnie" Huang
- Novena EVT1
- Copyrights: CC-BY-SA 3.0
- See http://bunniestudios.com/XL.html
- Patents: XL cross license
- (in symbol GLI8024-48_4) GL852GC / LQFP48
- (in symbol PCIMX6Q6VV1A, part G) i.MX6Q - USB

### Library data of the parts
C10U C11U C12U C13U C14U C15U C16U C17U C18U C19U C20U C21U C22U C23U C25U C26U C27U C29U C30U C31U C32U C37U C38U C39U C40U C41U C42U C43U C44U C45U C46U C47U C48U C49U C51U C52U C53U C54U C55U C56U = Cap Semi: Capacitor (Semiconductor SIM Model); Published: 8-Jun-2000; LatestRevisionDate: 17-Jul-2002; LatestRevisionNote: Re-released for DXP Platform.; PackageReference: C1206; Publisher: Altium Limited
C24U C50U = Cap Pol3: Polarized Capacitor (Surface Mount); Published: 8-Jun-2000; LatestRevisionDate: 17-Jul-2002; LatestRevisionNote: Re-released for DXP Platform.; PackageReference: C0805; Publisher: Altium Limited
C28U C36U = CAP_NP_Dup1: CAP CER 0.22UF 6.3V 20% X5R 0201; CLASS: DISCRETE; AGILE_PN: 150-75465; DESCRIPTION: CAP CER 0.01UF 6.3V 10% X7R 0201; MFG_NAME01: MURATA; MFG_PN01: GRM033R70J103KA01D; CAD_APPROVED: YES; FPLIST: CC0201,CC0201_HD,0201_CC,cc_0201_cir; PRIORITY_PN: 021-00273; ROOM: CPU; Tolerance: 10%; ROHS: Yes; HEIGHT: 0.33 MM
C33U = CAP_NP_Dup1: CAP CER 0.22UF 6.3V 20% X5R 0201; CLASS: DISCRETE; ROOM: CPU; PRIORITY_PN: 021-00278; FPLIST: CC0201,CC0201_HD,0201_CC; CAD_APPROVED: Yes; MFG_PN01: JMK063BJ224MP-F; MFG_NAME01: TAIYO YUDEN; AGILE_PN: 150-77852; HEIGHT: 0.33 MM; ROHS: Yes; Tolerance: 20%
C34U = CAP_NP_Dup1: CAP CER 10UF 6.3V 10% X5R 0603; CLASS: DISCRETE; AGILE_PN: 150-77832; MFG_NAME01: CAL-CHIP; MFG_PN01: GMC10X5R106K6R3NT-LF; CAD_APPROVED: Yes; FPLIST: CC0603_OV,CC0603,0603_CC; PRIORITY_PN: 021-00276; Tolerance: 10%; ROHS: Yes; HEIGHT: 1.0MM
D10U D13U D15U D16U D17U = Tranzorb: Published: 24-Mar-1999; LatestRevisionDate: 17-Jul-2002; LatestRevisionNote: Re-released for DXP Platform.; PackageReference: DO-7; Publisher: Altium Limited
D11U D12U D14U = RCLAMP0502B: 2-channel ESD/CDE protection device for 5V devices
L10U L11U L13U L14U = Inductor Iron: Magnetic-Core Inductor; Published: 24-Mar-1999; LatestRevisionDate: 17-Jul-2002; LatestRevisionNote: Re-released for DXP Platform.; PackageReference: AXIAL-0.9; Publisher: Altium Limited
L12U L15U = USB_EMI_CHOKE: USB common mode EMI choke (90 ohms)
P10U = USB_MINI-AB_1: Micro USB B type connector, i.e. FCI 10103594
P11U P13U = Header 4: Header, 4-Pin; LatestRevisionDate: 17-Jul-2002; LatestRevisionNote: Re-released for DXP Platform.; Publisher: Altium Limited
P12U = Header 5: Two items: wifi card plus 5-pin, 2mm pitch male pin header, 3.5 to 4mm tall pins; LatestRevisionDate: 17-Jul-2002; LatestRevisionNote: Re-released for DXP Platform.; Publisher: Altium Limited
P14U = Header 4X2H: Header, 4-Pin, Dual row, Right Angle; LatestRevisionDate: 17-Jul-2002; LatestRevisionNote: Re-released for DXP Platform.; Publisher: Altium Limited
R10U R12U R13U R14U R15U R16U R17U R18U R19U R20U R21U R23U R24U R25U R26U R27U R28U R30U R31U R32U R33U R34U R35U R36U R38U R39U R40U R41U = Res1: Resistor; Value: 100k; Published: 8-Jun-2000; LatestRevisionDate: 17-Jul-2002; LatestRevisionNote: Re-released for DXP Platform.; PackageReference: AXIAL-0.3; Publisher: Altium Limited
R11U R29U R42U = Res1: Resistor; Published: 8-Jun-2000; LatestRevisionDate: 17-Jul-2002; LatestRevisionNote: Re-released for DXP Platform.; PackageReference: AXIAL-0.3; Publisher: Altium Limited; Value: 100k
R22U R37U = Res3: Resistor; Published: 8-Jun-2000; LatestRevisionDate: 04-Mar-2005; LatestRevisionNote: PCB Footprint replaced.; PackageReference: J1-0603; Publisher: Altium Limited
U10U U13U = GLI8024-48_4: 4-port multiple-TT hub with USB charging support
U11U U14U = RT9711BGB: 1.5A high-side power switch, active low enable
U12U U15U U16U = RT9706: IC LIN SW W/FLAG 500MA 2.0-5.5V SOT23-5; AGILE_PN: 315-77830; MFG_NAME01: RICHTEK; MFG_PN01: RT9706PB; CAD_APPROVED: Yes; ROHS: Yes; HEIGHT: 1.295MM
U100 = PCIMX6Q6VV1A: as U100 on sheet 06cpu_soc; MFG_PN01: PCIMX6Q6VV1A; ROHS: Yes; HEIGHT: 2.16MM
Y10U Y11U = XTAL: Crystal Oscillator; Published: 8-Jun-2000; LatestRevisionDate: 17-Jul-2002; LatestRevisionNote: Re-released for DXP Platform.; PackageReference: R38; Publisher: Altium Limited

## Sheet 09sata.SchDoc
size A
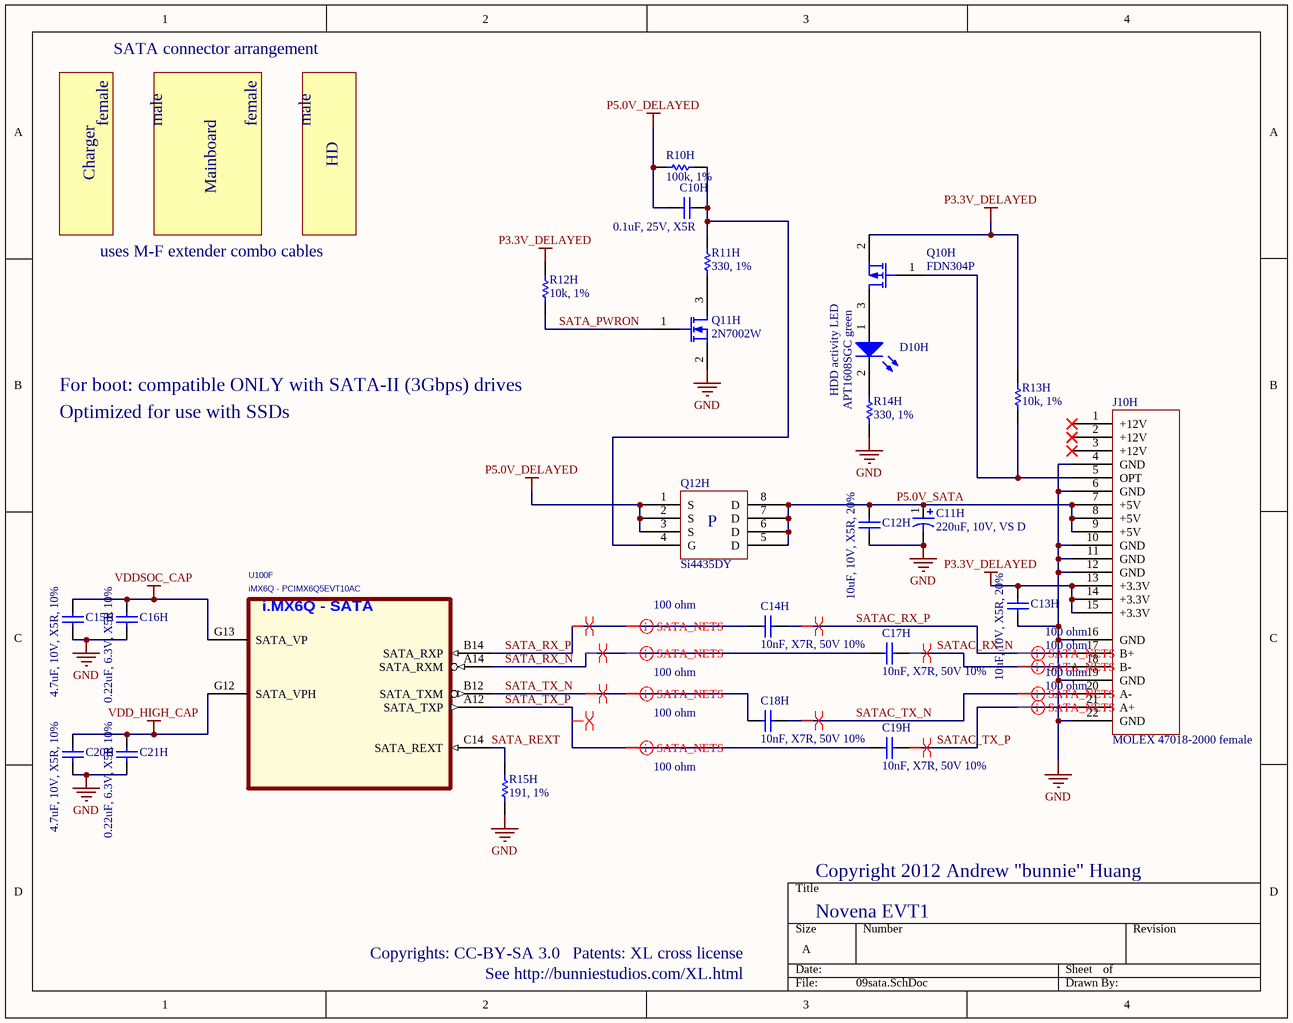
[diagram p9: 09sata.SchDoc]

### Parts
C10H  0.1uF, 25V, X5R  [CAPC1005N]
C11H  220uF, 10V, VS D  [ALCAP_D]
C12H  10uF, 10V, X5R, 20%  [CAPC1608N]
C13H  10uF, 10V, X5R, 20%  [CAPC1608N]
C14H  10nF, X7R, 50V 10%  [CAPC1005N]
C15H  4.7uF, 10V, X5R, 10%  [CAPC1608N_HD]
C16H  0.22uF, 6.3V, X5R 10%  [CAPC0603N_B]
C17H  10nF, X7R, 50V 10%  [CAPC1005N]
C18H  10nF, X7R, 50V 10%  [CAPC1005N]
C19H  10nF, X7R, 50V 10%  [CAPC1005N]
C20H  4.7uF, 10V, X5R, 10%  [CAPC1608N_HD]
C21H  0.22uF, 6.3V, X5R 10%  [CAPC0603N_B]
D10H  APT1608SGC green  [CD1608-0603]
J10H  MOLEX 47018-2000 female  [SATA_MOLEX_47018_2000]
Q10H  FDN304P  [SOT23-3N]
Q11H  2N7002W  [SOT323-3AN]
Q12H  Si4435DY  [SOIC127P600-8AN]
R10H  100k, 1%  [RESC1005N]
R11H  330, 1%  [RESC1005N]
R12H  10k, 1%  [RESC1005N]
R13H  10k, 1%  [RESC1005N]
R14H  330, 1%  [RESC1005N]
R15H  191, 1%  [RESC1005N]
U100  iMX6Q - PCIMX6Q5EVT10AC  [FREESCALE_BGA624C80P25X25_2100X2100X216]  (part F of 12)

### Nets
GND: C11H.2 C12H.2 C13H.2 C15H.2 C16H.2 C20H.2 C21H.2 J10H.4(GND) J10H.6(GND) J10H.10(GND) J10H.11(GND) J10H.12(GND) J10H.16(GND) J10H.19(GND) J10H.22(GND) Q11H.2(S) R14H.1 R15H.2
P3.3V_DELAYED: C13H.1 J10H.13(+3.3V) J10H.14(+3.3V) J10H.15(+3.3V) Q10H.2(S) R12H.1 R13H.1
P5.0V_DELAYED: C10H.1 Q12H.1(S) Q12H.2(S) Q12H.3(S) R10H.2
VDD_HIGH_CAP: C20H.1 C21H.1 U100.G12(SATA_VPH)
VDDSOC_CAP: C15H.1 C16H.1 U100.G13(SATA_VP)
P5.0V_SATA: C11H.1 C12H.1 J10H.7(+5V) J10H.8(+5V) J10H.9(+5V) Q12H.5(D) Q12H.6(D) Q12H.7(D) Q12H.8(D)
SATA_PWRON: Q11H.1(G) R12H.2
SATA_REXT: R15H.1 U100.C14(SATA_REXT)
SATA_RX_N: C17H.1 U100.A14(SATA_RXM)
SATA_RX_P: C14H.1 U100.B14(SATA_RXP)
SATA_TX_N: C18H.1 U100.B12(SATA_TXM)
SATA_TX_P: C19H.1 U100.A12(SATA_TXP)
SATAC_RX_N: C17H.2 J10H.18(B-)
SATAC_RX_P: C14H.2 J10H.17(B+)
SATAC_TX_N: C18H.2 J10H.20(A-)
SATAC_TX_P: C19H.2 J10H.21(A+)
NetC10H_2: C10H.2 Q12H.4(G) R10H.1 R11H.1
NetD10H_1: D10H.1(A) Q10H.3(D)
NetD10H_2: D10H.2(K) R14H.2
NetJ10H_5: J10H.5(OPT) Q10H.1(G) R13H.2
NetQ11H_3: Q11H.3(D) R11H.2

Not connected (* = marked no-connect by the designer): J10H 1(+12V)* 2(+12V)* 3(+12V)*

### Layout directives
differential pair: SATA_RX_N, SATA_RX_P, SATA_TX_N, SATA_TX_P, SATAC_RX_N, SATAC_RX_P, SATAC_TX_N, SATAC_TX_P
net class SATA_NETS; Impedance: 100 ohm: SATA_RX_N, SATA_RX_P, SATA_TX_N, SATA_TX_P, SATAC_RX_N, SATAC_RX_P, SATAC_TX_N, SATAC_TX_P

### Notes on the sheet
- SATA connector arrangement
- female
- male
- HD
- Charger
- Mainboard
- uses M-F extender combo cables
- For boot: compatible ONLY with SATA-II (3Gbps) drives
- Optimized for use with SSDs
- HDD activity LED
- Copyright 2012 Andrew "bunnie" Huang
- Copyrights: CC-BY-SA 3.0
- Patents: XL cross license
- Novena EVT1
- See http://bunniestudios.com/XL.html
- (in symbol PCIMX6Q6VV1A, part F) i.MX6Q - SATA
- (in symbol Si4435DY) P

### Library data of the parts
C10H C12H C13H C14H C15H C17H C18H C19H C20H = Cap Semi: Capacitor (Semiconductor SIM Model); Published: 8-Jun-2000; LatestRevisionDate: 17-Jul-2002; LatestRevisionNote: Re-released for DXP Platform.; PackageReference: C1206; Publisher: Altium Limited
C11H = Cap Pol3: Polarized Capacitor (Surface Mount); Published: 8-Jun-2000; LatestRevisionDate: 17-Jul-2002; LatestRevisionNote: Re-released for DXP Platform.; PackageReference: C0805; Publisher: Altium Limited
C16H C21H = Cap Semi: CAP CER 0.22UF 6.3V 20% X5R 0201; Published: 8-Jun-2000; LatestRevisionDate: 17-Jul-2002; LatestRevisionNote: Re-released for DXP Platform.; PackageReference: C1206; Publisher: Altium Limited
D10H = LED2: Typical RED, GREEN, YELLOW, AMBER GaAs LED; Published: 8-Jun-2000; LatestRevisionDate: 17-Jul-2002; LatestRevisionNote: Re-released for DXP Platform.; PackageVersion: Feb-2002; PackageReference: 3.2X1.6X1.1; Publisher: Altium Limited
J10H = SATA_22P_HEADER: SATA+Power connector
Q10H = MOSFET-P: P-Channel MOSFET; Published: 8-Jun-2000; LatestRevisionDate: 17-Jul-2002; LatestRevisionNote: Re-released for DXP Platform.; PackageVersion: 1995/1996; PackageReference: E3; Publisher: Altium Limited; PackageDescription: TO, Flat Index; 3 In-Line, Axial Leads; Body Dia. 4.6mm; Lead Dia. 0.5 mm (max)
Q11H = MOSFET-N: N-Channel MOSFET; Published: 8-Jun-2000; LatestRevisionDate: 17-Jul-2002; LatestRevisionNote: Re-released for DXP Platform.; PackageVersion: 1995/1996; PackageReference: E3; Publisher: Altium Limited
Q12H = Si4435DY: Singre P-channel FET, 8A, 30V
R10H = Res1: Resistor; Published: 8-Jun-2000; LatestRevisionDate: 17-Jul-2002; LatestRevisionNote: Re-released for DXP Platform.; PackageReference: AXIAL-0.3; Publisher: Altium Limited; Value: 100k
R11H R12H R13H R14H R15H = Res1: Resistor; Value: 100k; Published: 8-Jun-2000; LatestRevisionDate: 17-Jul-2002; LatestRevisionNote: Re-released for DXP Platform.; PackageReference: AXIAL-0.3; Publisher: Altium Limited
U100 = PCIMX6Q6VV1A: as U100 on sheet 06cpu_soc; MFG_PN01: PCIMX6Q6VV1A; ROHS: Yes; HEIGHT: 2.16MM

## Sheet 10ethernet100.SchDoc
size C
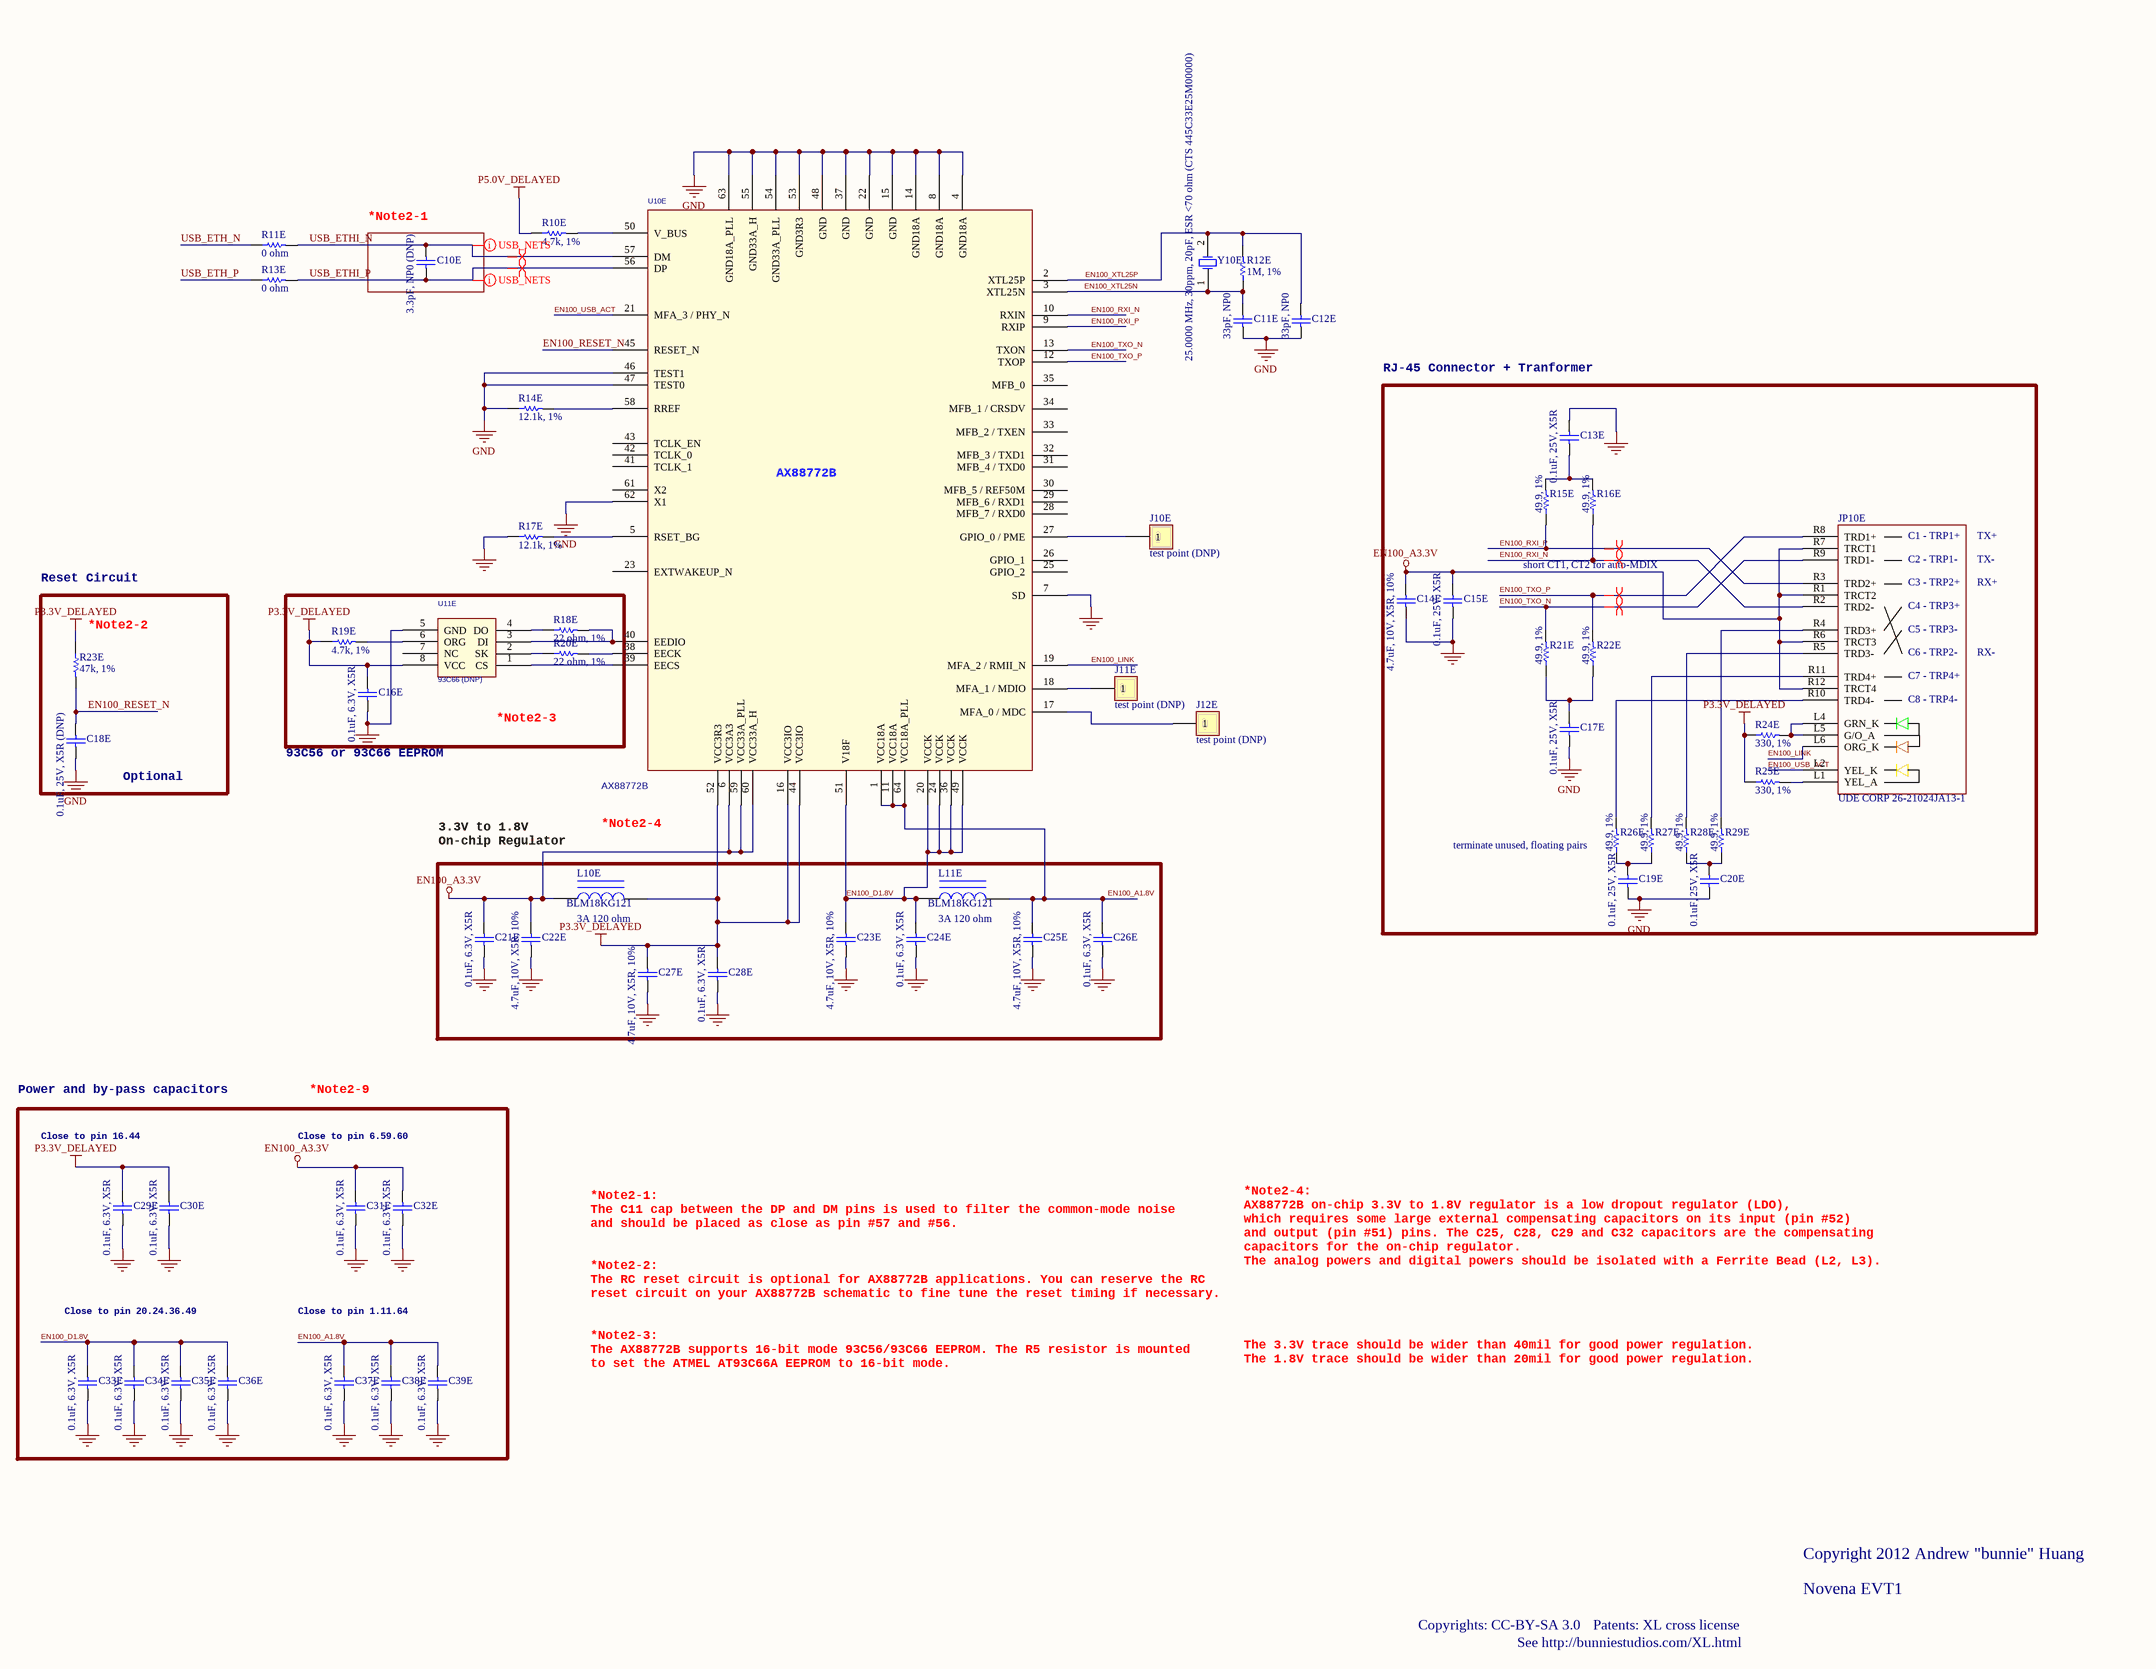
[diagram p10: 10ethernet100.SchDoc]

### Parts
C10E  3.3pF, NP0 (DNP)  [CAPC1005N]
C11E  33pF, NP0  [CAPC1005N]
C12E  33pF, NP0  [CAPC1005N]
C13E  0.1uF, 25V, X5R  [CAPC1005N]
C14E  4.7uF, 10V, X5R, 10%  [CAPC1608N]
C15E  0.1uF, 25V, X5R  [CAPC1005N]
C16E  0.1uF, 6.3V, X5R  [CAPC0603N_B]
C17E  0.1uF, 25V, X5R  [CAPC1005N]
C18E  0.1uF, 25V, X5R (DNP)  [CAPC1005N]
C19E  0.1uF, 25V, X5R  [CAPC1005N]
C20E  0.1uF, 25V, X5R  [CAPC1005N]
C21E  0.1uF, 6.3V, X5R  [CAPC0603N_B]
C22E  4.7uF, 10V, X5R, 10%  [CAPC1608N]
C23E  4.7uF, 10V, X5R, 10%  [CAPC1608N]
C24E  0.1uF, 6.3V, X5R  [CAPC0603N_B]
C25E  4.7uF, 10V, X5R, 10%  [CAPC1608N]
C26E  0.1uF, 6.3V, X5R  [CAPC0603N_B]
C27E  4.7uF, 10V, X5R, 10%  [CAPC1608N]
C28E  0.1uF, 6.3V, X5R  [CAPC0603N_B]
C29E  0.1uF, 6.3V, X5R  [CAPC0603N_B]
C30E  0.1uF, 6.3V, X5R  [CAPC0603N_B]
C31E  0.1uF, 6.3V, X5R  [CAPC0603N_B]
C32E  0.1uF, 6.3V, X5R  [CAPC0603N_B]
C33E  0.1uF, 6.3V, X5R  [CAPC0603N_B]
C34E  0.1uF, 6.3V, X5R  [CAPC0603N_B]
C35E  0.1uF, 6.3V, X5R  [CAPC0603N_B]
C36E  0.1uF, 6.3V, X5R  [CAPC0603N_B]
C37E  0.1uF, 6.3V, X5R  [CAPC0603N_B]
C38E  0.1uF, 6.3V, X5R  [CAPC0603N_B]
C39E  0.1uF, 6.3V, X5R  [CAPC0603N_B]
J10E  test point (DNP)  [TP_SMT_38mil]
J11E  test point (DNP)  [TP_SMT_38mil]
J12E  test point (DNP)  [TP_SMT_38mil]
JP10E  UDE CORP 26-21024JA13-1  [UDE_CORP_26-21024JA13-1]
L10E  BLM18KG121  value 3A 120 ohm  [INDC1608AN]
L11E  BLM18KG121  value 3A 120 ohm  [INDC1608AN]
R10E  4.7k, 1%  [RESC1005N]
R11E  0 ohm  [RESC1005N]
R12E  1M, 1%  [RESC1005N]
R13E  0 ohm  [RESC1005N]
R14E  12.1k, 1%  [RESC1005N]
R15E  49.9, 1%  [RESC1005N]
R16E  49.9, 1%  [RESC1005N]
R17E  12.1k, 1%  [RESC1005N]
R18E  22 ohm, 1%  [RESC1005N]
R19E  4.7k, 1%  [RESC1005N]
R20E  22 ohm, 1%  [RESC1005N]
R21E  49.9, 1%  [RESC1005N]
R22E  49.9, 1%  [RESC1005N]
R23E  47k, 1%  [RESC1005N]
R24E  330, 1%  [RESC1005N]
R25E  330, 1%  [RESC1005N]
R26E  49.9, 1%  [RESC1005N]
R27E  49.9, 1%  [RESC1005N]
R28E  49.9, 1%  [RESC1005N]
R29E  49.9, 1%  [RESC1005N]
U10E  AX88772B  [TSQFP40P900X900-64N]
U11E  93C66 (DNP)  [TSOP65P640-8AN]
Y10E  25.0000 MHz, 30ppm, 20pF, ESR <70 ohm (CTS 445C33E25M00000)  [NDK_NX5032A]

### Blocks framed on the sheet
*Note2-1: C10E
RJ-45 Connector + Tranformer: C13E C14E C15E C17E C19E C20E JP10E R15E R16E R21E R22E R24E R25E R26E R27E R28E R29E
*Note2-3: C16E R18E R19E R20E U11E

### Nets
EN100_A3.3V: C14E.1 C15E.1 C21E.1 C22E.1 C31E.1 C32E.1 JP10E.R1(TRCT2) JP10E.R6(TRCT3) JP10E.R7(TRCT1) JP10E.R12(TRCT4) L10E.1 U10E.6(VCC3A3) U10E.59(VCC33A_PLL) U10E.60(VCC33A_H)
GND: C11E.2 C12E.2 C13E.1 C14E.2 C15E.2 C16E.2 C17E.2 C18E.2 C19E.2 C20E.2 C21E.2 C22E.2 C23E.2 C24E.2 C25E.2 C26E.2 C27E.2 C28E.2 C29E.2 C30E.2 C31E.2 C32E.2 C33E.2 C34E.2 C35E.2 C36E.2 C37E.2 C38E.2 C39E.2 R14E.1 R17E.1 U10E.4(GND18A) U10E.7(SD) U10E.8(GND18A) U10E.14(GND18A) U10E.15(GND) U10E.22(GND) U10E.37(GND) U10E.46(TEST1) U10E.47(TEST0) U10E.48(GND) U10E.53(GND3R3) U10E.54(GND33A_PLL) U10E.55(GND33A_H) U10E.62(X1) U10E.63(GND18A_PLL) U11E.5(GND)
P3.3V_DELAYED: C16E.1 C27E.1 C28E.1 C29E.1 C30E.1 L10E.2 R19E.1 R23E.1 R24E.1 R25E.1 U10E.16(VCC3IO) U10E.44(VCC3IO) U10E.52(VCC3R3) U11E.8(VCC)
P5.0V_DELAYED: R10E.1
EN100_A1.8V: C25E.1 C26E.1 C37E.1 C38E.1 C39E.1 L11E.2 U10E.1(VCC18A) U10E.11(VCC18A) U10E.64(VCC18A_PLL)
EN100_D1.8V: C23E.1 C24E.1 C33E.1 C34E.1 C35E.1 C36E.1 L11E.1 U10E.20(VCCK) U10E.24(VCCK) U10E.36(VCCK) U10E.49(VCCK) U10E.51(V18F)
EN100_LINK: JP10E.L6(ORG_K) U10E.19(MFA_2_/_RMII_N)
EN100_RESET_N: C18E.1 R23E.2 U10E.45(RESET_N)
EN100_RXI_N: JP10E.R2(TRD2-) R16E.1 U10E.10(RXIN)
EN100_RXI_P: JP10E.R3(TRD2+) R15E.1 U10E.9(RXIP)
EN100_TXO_N: JP10E.R9(TRD1-) R21E.2 U10E.13(TXON)
EN100_TXO_P: JP10E.R8(TRD1+) R22E.2 U10E.12(TXOP)
EN100_USB_ACT: JP10E.L2(YEL_K) U10E.21(MFA_3_/_PHY_N)
EN100_XTL25N: C11E.1 R12E.1 U10E.3(XTL25N) Y10E.1(OSC1)
EN100_XTL25P: C12E.1 R12E.2 U10E.2(XTL25P) Y10E.2(OSC2)
USB_ETH_N: R11E.1
USB_ETH_P: R13E.1
USB_ETHI_N: C10E.1 R11E.2 U10E.57(DM)
USB_ETHI_P: C10E.2 R13E.2 U10E.56(DP)
NetC13E_2: C13E.2 R15E.2 R16E.2
NetC17E_1: C17E.1 R21E.1 R22E.1
NetC19E_1: C19E.1 R26E.1 R27E.1
NetC20E_1: C20E.1 R28E.1 R29E.1
NetJ10E_1: J10E.1 U10E.27(GPIO_0_/_PME)
NetJ11E_1: J11E.1 U10E.18(MFA_1_/_MDIO)
NetJ12E_1: J12E.1 U10E.17(MFA_0_/_MDC)
NetJP10E_L1: JP10E.L1(YEL_A) R25E.2
NetJP10E_L4: JP10E.L4(GRN_K) JP10E.L5(G/O_A) R24E.2
NetJP10E_R4: JP10E.R4(TRD3+) R29E.2
NetJP10E_R5: JP10E.R5(TRD3-) R28E.2
NetJP10E_R10: JP10E.R10(TRD4-) R26E.2
NetJP10E_R11: JP10E.R11(TRD4+) R27E.2
NetR10E_2: R10E.2 U10E.50(V_BUS)
NetR14E_2: R14E.2 U10E.58(RREF)
NetR17E_2: R17E.2 U10E.5(RSET_BG)
NetR18E_1: R18E.1 U11E.4(DO)
NetR18E_2: R18E.2 U10E.40(EEDIO) U11E.3(DI)
NetR19E_2: R19E.2 U11E.6(ORG)
NetR20E_1: R20E.1 U11E.2(SK)
NetR20E_2: R20E.2 U10E.38(EECK)
NetU10E_39: U10E.39(EECS) U11E.1(CS)

Not connected (* = marked no-connect by the designer): U10E 23(EXTWAKEUP_N) 25(GPIO_2) 26(GPIO_1) 28(MFB_7_/_RXD0) 29(MFB_6_/_RXD1) 30(MFB_5_/_REF50M) 31(MFB_4_/_TXD0) 32(MFB_3_/_TXD1) 33(MFB_2_/_TXEN) 34(MFB_1_/_CRSDV) 35(MFB_0) 41(TCLK_1) 42(TCLK_0) 43(TCLK_EN) 61(X2); U11E 7(NC)

### Layout directives
differential pair: EN100_RXI_N, EN100_RXI_P, EN100_TXO_N, EN100_TXO_P, USB_ETHI_N, USB_ETHI_P
net class USB_NETS: USB_ETHI_N, USB_ETHI_P

### Notes on the sheet
- TX+
- Reset Circuit
- short CT1, CT2 for auto-MDIX
- RX+
- TX-
- (near R23E) *Note2-2
- RX-
- Optional
- 93C56 or 93C66 EEPROM
- *Note2-4
- 3.3V to 1.8V
  On-chip Regulator
- (near R26E) terminate unused, floating pairs
- Power and by-pass capacitors
- *Note2-9
- Close to pin 16.44
- Close to pin 6.59.60
- *Note2-1:
  The C11 cap between the DP and DM pins is used to filter the common-mode noise
  and should be placed as close as pin #57 and #56.
- *Note2-4:
  AX88772B on-chip 3.3V to 1.8V regulator is a low dropout regulator (LDO),
  which requires some large external compensating capacitors on its input (pin #52)
  and output (pin #51) pins. The C25, C28, C29 and C32 capacitors are the compensating
  capacitors for the on-chip regulator.
  The analog powers and digital powers should be isolated with a Ferrite Bead (L2, L3).
- Close to pin 20.24.36.49
- Close to pin 1.11.64
- *Note2-2:
  The RC reset circuit is optional for AX88772B applications. You can reserve the RC
  reset circuit on your AX88772B schematic to fine tune the reset timing if necessary.
- *Note2-3:
  The AX88772B supports 16-bit mode 93C56/93C66 EEPROM. The R5 resistor is mounted
  to set the ATMEL AT93C66A EEPROM to 16-bit mode.
- The 3.3V trace should be wider than 40mil for good power regulation.
  The 1.8V trace should be wider than 20mil for good power regulation.
- Copyright 2012 Andrew "bunnie" Huang
- Novena EVT1
- Copyrights: CC-BY-SA 3.0
- See http://bunniestudios.com/XL.html
- Patents: XL cross license
- (in symbol UDE_CORP_26-21024JA13-1) C1 - TRP1+; C2 - TRP1-; C3 - TRP2+; C4 - TRP3+; C5 - TRP3-; C6 - TRP2-; C7 - TRP4+; C8 - TRP4-

### Library data of the parts
C10E C11E C12E C13E C14E C15E C16E C17E C18E C19E C20E C21E C22E C23E C24E C25E C26E C27E C28E C29E C30E C31E C32E C33E C34E C35E C36E C37E C38E C39E = Cap Semi: Capacitor (Semiconductor SIM Model); Published: 8-Jun-2000; LatestRevisionDate: 17-Jul-2002; LatestRevisionNote: Re-released for DXP Platform.; PackageReference: C1206; Publisher: Altium Limited
J10E J11E J12E = CON1: Connector
JP10E = UDE_CORP_26-21024JA13-1: 10/100/1000BT + magnetics, symmetric, tab up, with LEDs
L10E L11E = Inductor Iron: Magnetic-Core Inductor; Published: 24-Mar-1999; LatestRevisionDate: 17-Jul-2002; LatestRevisionNote: Re-released for DXP Platform.; PackageReference: AXIAL-0.9; Publisher: Altium Limited
R10E R11E R12E R13E R14E R15E R16E R17E R18E R19E R20E R21E R22E R23E R24E R25E R26E R27E R28E R29E = Res1: Resistor; Value: 100k; Published: 8-Jun-2000; LatestRevisionDate: 17-Jul-2002; LatestRevisionNote: Re-released for DXP Platform.; PackageReference: AXIAL-0.3; Publisher: Altium Limited
U10E = AX88772B_28
U11E = 93c66_0
Y10E = XTAL: Crystal Oscillator; Published: 8-Jun-2000; LatestRevisionDate: 17-Jul-2002; LatestRevisionNote: Re-released for DXP Platform.; PackageReference: R38; Publisher: Altium Limited

## Sheet 11ethernetGbit.SchDoc
size B
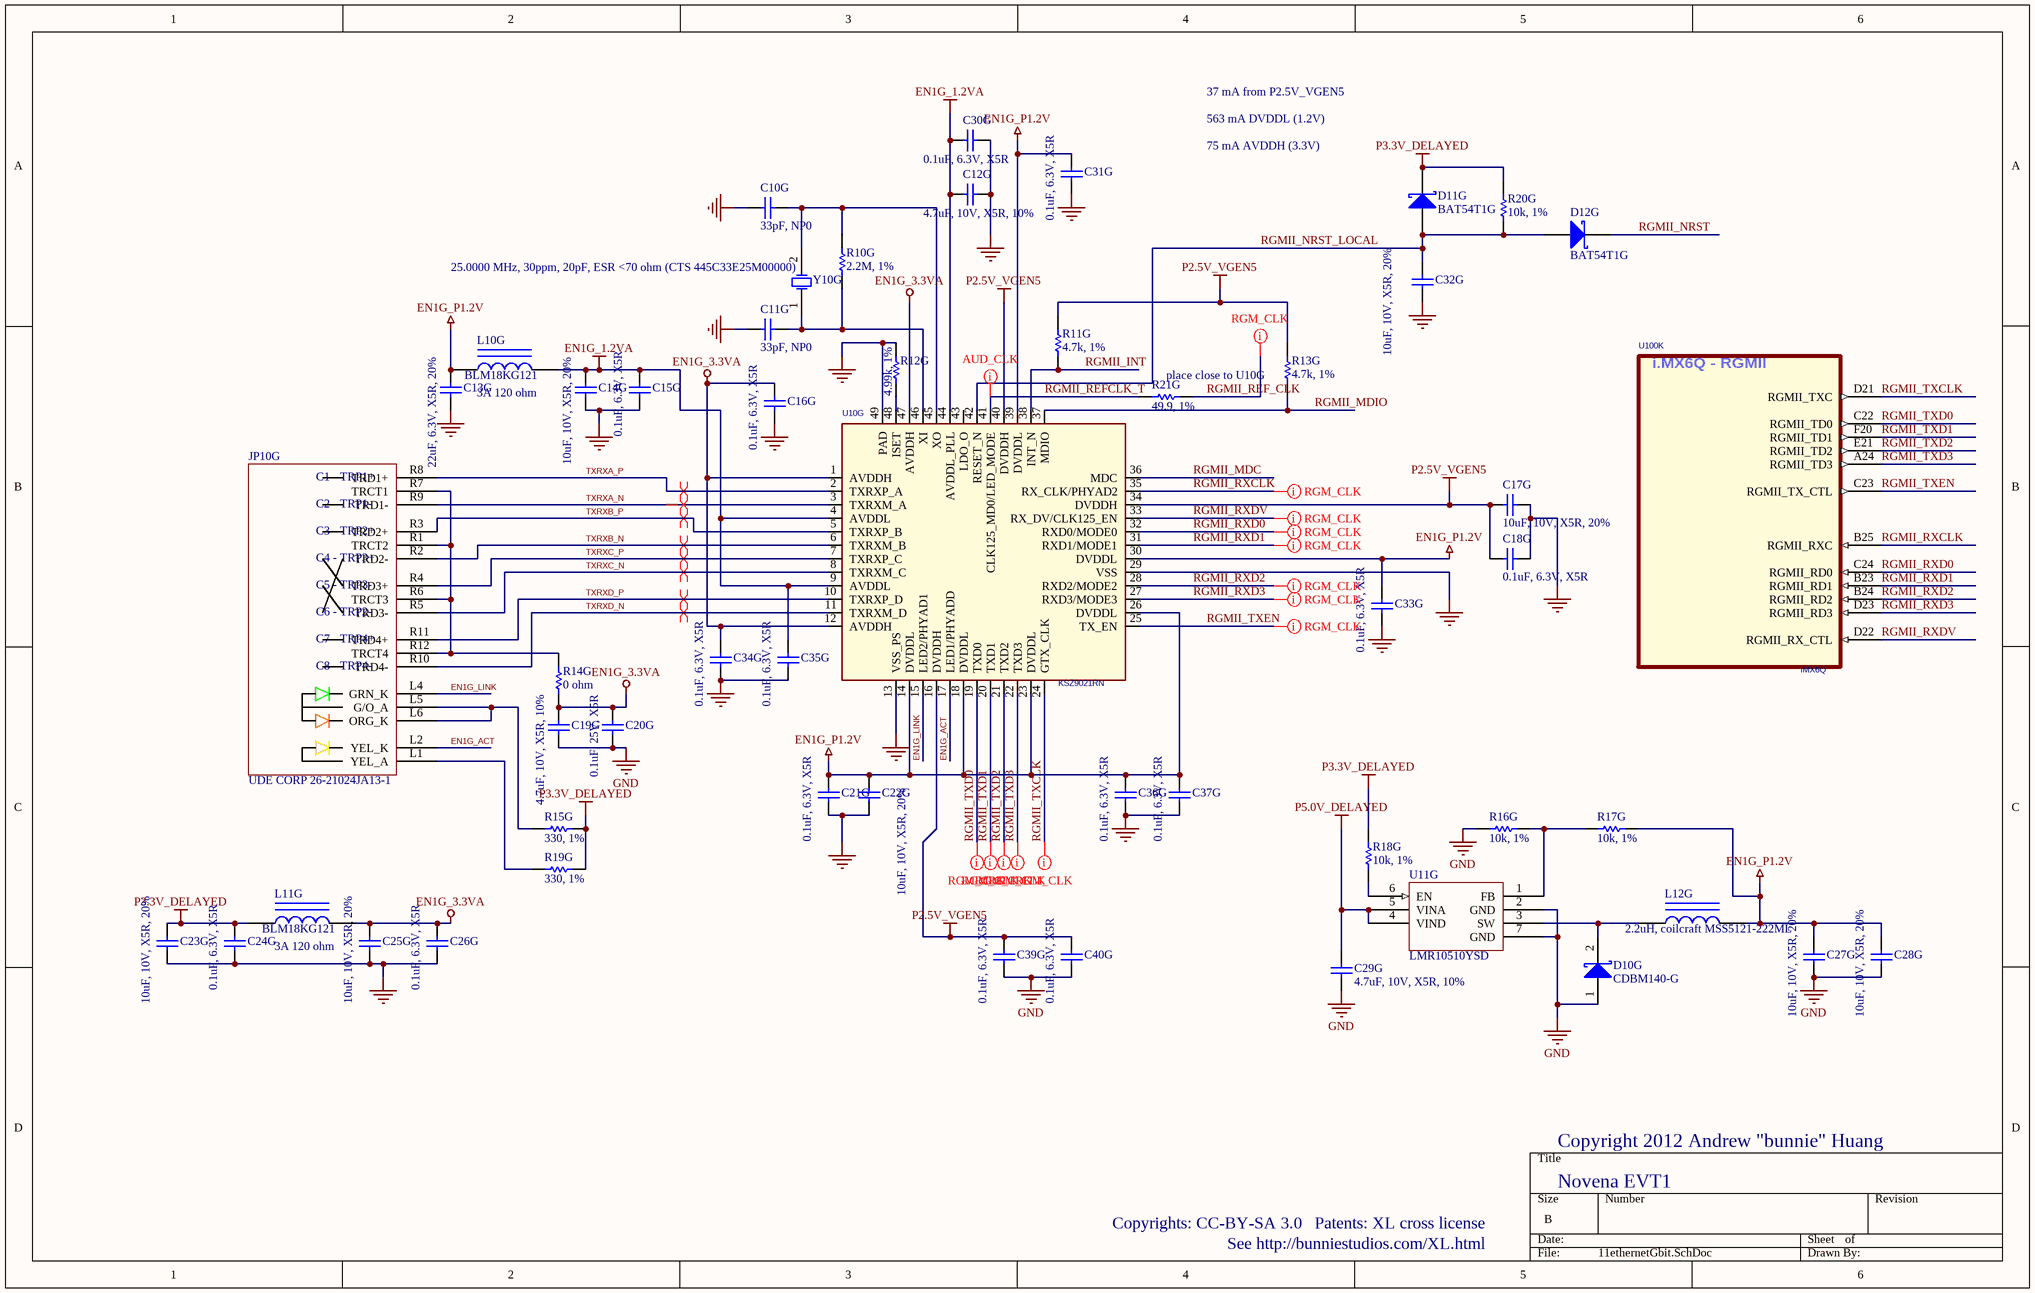
[diagram p11: 11ethernetGbit.SchDoc]

### Parts
C10G  33pF, NP0  [CAPC1005N]
C11G  33pF, NP0  [CAPC1005N]
C12G  4.7uF, 10V, X5R, 10%  [CAPC1608N]
C13G  22uF, 6.3V, X5R, 20%  [CAPC1608N_HD]
C14G  10uF, 10V, X5R, 20%  [CAPC1608N]
C15G  0.1uF, 6.3V, X5R  [CAPC0603N_B]
C16G  0.1uF, 6.3V, X5R  [CAPC0603N_B]
C17G  10uF, 10V, X5R, 20%  [CAPC1608N]
C18G  0.1uF, 6.3V, X5R  [CAPC0603N_B]
C19G  4.7uF, 10V, X5R, 10%  [CAPC1608N]
C20G  0.1uF, 25V, X5R  [CAPC1005N]
C21G  0.1uF, 6.3V, X5R  [CAPC0603N_B]
C22G  10uF, 10V, X5R, 20%  [CAPC1608N]
C23G  10uF, 10V, X5R, 20%  [CAPC1608N]
C24G  0.1uF, 6.3V, X5R  [CAPC0603N_B]
C25G  10uF, 10V, X5R, 20%  [CAPC1608N]
C26G  0.1uF, 6.3V, X5R  [CAPC0603N_B]
C27G  10uF, 10V, X5R, 20%  [CAPC1608N]
C28G  10uF, 10V, X5R, 20%  [CAPC1608N]
C29G  4.7uF, 10V, X5R, 10%  [CAPC1608N]
C30G  0.1uF, 6.3V, X5R  [CAPC0603N_B]
C31G  0.1uF, 6.3V, X5R  [CAPC0603N_B]
C32G  10uF, 10V, X5R, 20%  [CAPC1608N]
C33G  0.1uF, 6.3V, X5R  [CAPC0603N_B]
C34G  0.1uF, 6.3V, X5R  [CAPC0603N_B]
C35G  0.1uF, 6.3V, X5R  [CAPC0603N_B]
C36G  0.1uF, 6.3V, X5R  [CAPC0603N_B]
C37G  0.1uF, 6.3V, X5R  [CAPC0603N_B]
C39G  0.1uF, 6.3V, X5R  [CAPC0603N_B]
C40G  0.1uF, 6.3V, X5R  [CAPC0603N_B]
D10G  CDBM140-G  [SOD123]
D11G  BAT54T1G  [SOD123]
D12G  BAT54T1G  [SOD123]
JP10G  UDE CORP 26-21024JA13-1  [UDE_CORP_26-21024JA13-1]
L10G  BLM18KG121  value 3A 120 ohm  [INDC1608AN]
L11G  BLM18KG121  value 3A 120 ohm  [INDC1608AN]
L12G  2.2uH, coilcraft MSS5121-222ML  [COILCRAFT_MSS5121]
R10G  2.2M, 1%  [RESC1005N]
R11G  4.7k, 1%  [RESC1005N]
R12G  4.99k, 1%  [RESC1005N]
R13G  4.7k, 1%  [RESC1005N]
R14G  0 ohm  [RESC1005N]
R15G  330, 1%  [RESC1005N]
R16G  10k, 1%  [RESC1005N]
R17G  10k, 1%  [RESC1005N]
R18G  10k, 1%  [RESC1005N]
R19G  330, 1%  [RESC1005N]
R20G  10k, 1%  [RESC1005N]
R21G  49.9, 1%  [RESC1005N]
U10G  KSZ9021RN  [MICREL_QFN48_EP]
U11G  LMR10510YSD  [SON95P300X300X80-7V]
U100  iMX6Q  [FREESCALE_BGA624C80P25X25_2100X2100X216]  (part K of 12)
Y10G  25.0000 MHz, 30ppm, 20pF, ESR <70 ohm (CTS 445C33E25M00000)  [NDK_NX5032A]

### Nets
EN1G_1.2VA: C12G.1 C14G.1 C15G.1 C30G.2 C35G.1 L10G.2 U10G.4(AVDDL) U10G.9(AVDDL) U10G.44(AVDDL_PLL)
EN1G_3.3VA: C16G.1 C19G.1 C20G.1 C25G.1 C26G.1 C34G.1 L11G.2 R14G.2 U10G.1(AVDDH) U10G.12(AVDDH) U10G.47(AVDDH)
EN1G_P1.2V: C13G.1 C21G.1 C22G.1 C27G.2 C28G.2 C31G.1 C33G.1 C36G.1 C37G.1 L10G.1 L12G.2 R17G.1 U10G.14(DVDDL) U10G.18(DVDDL) U10G.23(DVDDL) U10G.26(DVDDL) U10G.30(DVDDL) U10G.39(DVDDL)
GND: C10G.1 C11G.1 C12G.2 C13G.2 C14G.2 C15G.2 C16G.2 C17G.2 C18G.2 C19G.2 C20G.2 C21G.2 C22G.2 C23G.2 C24G.2 C25G.2 C26G.2 C27G.1 C28G.1 C29G.2 C30G.1 C31G.2 C32G.2 C33G.2 C34G.2 C35G.2 C36G.2 C37G.2 C39G.2 C40G.2 D10G.1(A) R12G.2 R16G.2 U10G.13(VSS_PS) U10G.29(VSS) U10G.49(PAD) U11G.2(GND) U11G.7(GND)
P2.5V_VGEN5: C17G.1 C18G.1 C39G.1 C40G.1 R11G.2 R13G.2 U10G.16(DVDDH) U10G.34(DVDDH) U10G.40(DVDDH)
P3.3V_DELAYED: C23G.1 C24G.1 D11G.2(K) L11G.1 R15G.2 R18G.2 R19G.2 R20G.2
P5.0V_DELAYED: C29G.1 U11G.4(VIND) U11G.5(VINA)
EN1G_ACT: JP10G.L2(YEL_K) U10G.17(LED1/PHYADD)
EN1G_LINK: JP10G.L4(GRN_K) U10G.15(LED2/PHYAD1)
RGMII_INT: R11G.1 U10G.38(INT_N)
RGMII_MDC: U10G.36(MDC)
RGMII_MDIO: R13G.1 U10G.37(MDIO)
RGMII_NRST: D12G.2(K)
RGMII_NRST_LOCAL: C32G.1 D11G.1(A) D12G.1(A) R20G.1 U10G.42(RESET_N)
RGMII_REF_CLK: R21G.2
RGMII_REFCLK_T: R21G.1 U10G.41(CLK125_MD0/LED_MODE)
RGMII_RXCLK: U10G.35(RX_CLK/PHYAD2) U100.B25(RGMII_RXC)
RGMII_RXD0: U10G.32(RXD0/MODE0) U100.C24(RGMII_RD0)
RGMII_RXD1: U10G.31(RXD1/MODE1) U100.B23(RGMII_RD1)
RGMII_RXD2: U10G.28(RXD2/MODE2) U100.B24(RGMII_RD2)
RGMII_RXD3: U10G.27(RXD3/MODE3) U100.D23(RGMII_RD3)
RGMII_RXDV: U10G.33(RX_DV/CLK125_EN) U100.D22(RGMII_RX_CTL)
RGMII_TXCLK: U10G.24(GTX_CLK) U100.D21(RGMII_TXC)
RGMII_TXD0: U10G.19(TXD0) U100.C22(RGMII_TD0)
RGMII_TXD1: U10G.20(TXD1) U100.F20(RGMII_TD1)
RGMII_TXD2: U10G.21(TXD2) U100.E21(RGMII_TD2)
RGMII_TXD3: U10G.22(TXD3) U100.A24(RGMII_TD3)
RGMII_TXEN: U10G.25(TX_EN) U100.C23(RGMII_TX_CTL)
TXRXA_N: JP10G.R9(TRD1-) U10G.3(TXRXM_A)
TXRXA_P: JP10G.R8(TRD1+) U10G.2(TXRXP_A)
TXRXB_N: JP10G.R2(TRD2-) U10G.6(TXRXM_B)
TXRXB_P: JP10G.R3(TRD2+) U10G.5(TXRXP_B)
TXRXC_N: JP10G.R5(TRD3-) U10G.8(TXRXM_C)
TXRXC_P: JP10G.R4(TRD3+) U10G.7(TXRXP_C)
TXRXD_N: JP10G.R10(TRD4-) U10G.11(TXRXM_D)
TXRXD_P: JP10G.R11(TRD4+) U10G.10(TXRXP_D)
NetC10G_2: C10G.2 R10G.1 U10G.45(XO) Y10G.2(OSC2)
NetC11G_2: C11G.2 R10G.2 U10G.46(XI) Y10G.1(OSC1)
NetD10G_2: D10G.2(K) L12G.1 U11G.3(SW)
NetJP10G_L1: JP10G.L1(YEL_A) R19G.1
NetJP10G_L5: JP10G.L5(G/O_A) JP10G.L6(ORG_K) R15G.1
NetJP10G_R1: JP10G.R1(TRCT2) JP10G.R6(TRCT3) JP10G.R7(TRCT1) JP10G.R12(TRCT4) R14G.1
NetR12G_1: R12G.1 U10G.48(ISET)
NetR16G_1: R16G.1 R17G.2 U11G.1(FB)
NetR18G_1: R18G.1 U11G.6(EN)

Not connected (* = marked no-connect by the designer): U10G 43(LDO_O)

### Layout directives
differential pair: TXRXA_N, TXRXA_P, TXRXB_N, TXRXB_P, TXRXC_N, TXRXC_P, TXRXD_N, TXRXD_P
net class RGM_CLK; Impedance: 50 ohm: RGMII_REF_CLK, RGMII_RXCLK, RGMII_RXD0, RGMII_RXD1, RGMII_RXD2, RGMII_RXD3, RGMII_RXDV, RGMII_TXCLK, RGMII_TXD0, RGMII_TXD1, RGMII_TXD2, RGMII_TXD3, RGMII_TXEN
net class AUD_CLK: RGMII_REFCLK_T

### Notes on the sheet
- 37 mA from P2.5V_VGEN5
- 563 mA DVDDL (1.2V)
- 75 mA AVDDH (3.3V)
- (near R13G) place close to U10G
- Copyright 2012 Andrew "bunnie" Huang
- Copyrights: CC-BY-SA 3.0
- Patents: XL cross license
- Novena EVT1
- See http://bunniestudios.com/XL.html
- (in symbol PCIMX6Q6VV1A, part K) i.MX6Q - RGMII
- (in symbol UDE_CORP_26-21024JA13-1) C1 - TRP1+; C2 - TRP1-; C3 - TRP2+; C4 - TRP3+; C5 - TRP3-; C6 - TRP2-; C7 - TRP4+; C8 - TRP4-

### Library data of the parts
C10G C11G C12G C13G C14G C15G C16G C17G C18G C19G C20G C21G C22G C23G C24G C25G C26G C27G C28G C29G C30G C31G C32G C33G C34G C35G C36G C37G C39G C40G = Cap Semi: Capacitor (Semiconductor SIM Model); Published: 8-Jun-2000; LatestRevisionDate: 17-Jul-2002; LatestRevisionNote: Re-released for DXP Platform.; PackageReference: C1206; Publisher: Altium Limited
D10G D11G D12G = D Schottky: Schottky Diode; Code - JEDEC: DO-214-AA; Published: 8-Jun-2000; Publisher: Altium Limited; Revision: July-2002: Re-released for DXP Platform.
JP10G = UDE_CORP_26-21024JA13-1: as JP10E on sheet 10ethernet100
L10G L11G L12G = Inductor Iron: Magnetic-Core Inductor; Published: 24-Mar-1999; LatestRevisionDate: 17-Jul-2002; LatestRevisionNote: Re-released for DXP Platform.; PackageReference: AXIAL-0.9; Publisher: Altium Limited
R10G R11G R12G R13G R14G R15G R16G R17G R18G R19G R20G R21G = Res1: Resistor; Value: 100k; Published: 8-Jun-2000; LatestRevisionDate: 17-Jul-2002; LatestRevisionNote: Re-released for DXP Platform.; PackageReference: AXIAL-0.3; Publisher: Altium Limited
U10G = KSZ9021_0: Gigabit Ethernet PHY
U11G = LMR10515XSD: NatSemi 1.5A step-down regulator in LLP
U100 = PCIMX6Q6VV1A: PLACEHOLDER FOR FREESCALE PART NUMBER PMCIMX6Q6VV1A.; AGILE_PN: TMP-WF-14526; MFG_NAME01: Freescale Semiconductor; PRE_APN: 344-01218; MFG_PN01: PCIMX6Q6VV1A; ROHS: Yes; HEIGHT: 2.16MM
Y10G = XTAL: Crystal Oscillator; Published: 8-Jun-2000; LatestRevisionDate: 17-Jul-2002; LatestRevisionNote: Re-released for DXP Platform.; PackageReference: R38; Publisher: Altium Limited